# EAGLE design MAIN_CNTRL_v01 (EAGLE 9.7.0)

## Sheet 1 of 5
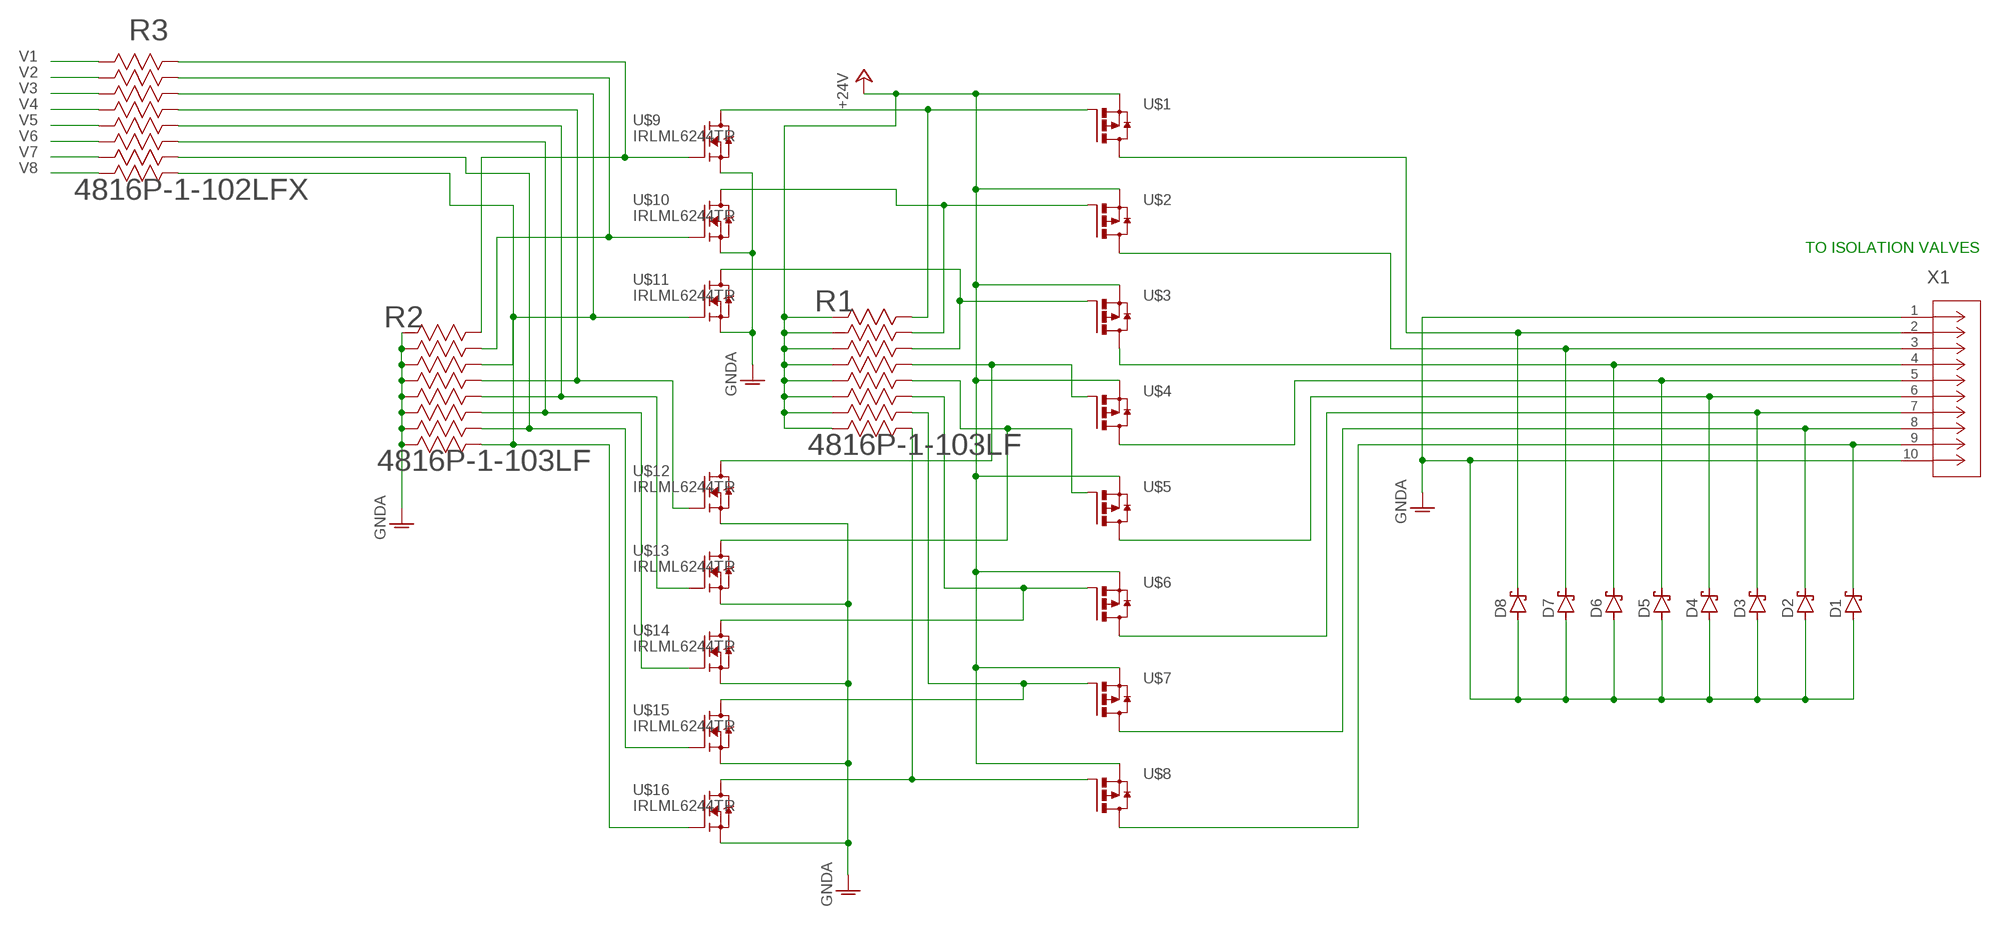
[diagram p0: schematic, sheet 1]

### Parts
D1  RB168VYM150FHTR  [DIO_RB160VAM_ROM]
D2  RB168VYM150FHTR  [DIO_RB160VAM_ROM]
D3  RB168VYM150FHTR  [DIO_RB160VAM_ROM]
D4  RB168VYM150FHTR  [DIO_RB160VAM_ROM]
D5  RB168VYM150FHTR  [DIO_RB160VAM_ROM]
D6  RB168VYM150FHTR  [DIO_RB160VAM_ROM]
D7  RB168VYM150FHTR  [DIO_RB160VAM_ROM]
D8  RB168VYM150FHTR  [DIO_RB160VAM_ROM]
R1  4816P-1-103LF  [BO_4816P]
R2  4816P-1-103LF  [BO_4816P]
R3  4816P-1-102LFX  4816P-1-102LF  [BO_4816P]
U$1  ZXMP7A17SOT223A  [SOT223]
U$2  ZXMP7A17SOT223A  [SOT223]
U$3  ZXMP7A17SOT223A  [SOT223]
U$4  ZXMP7A17SOT223A  [SOT223]
U$5  ZXMP7A17SOT223A  [SOT223]
U$6  ZXMP7A17SOT223A  [SOT223]
U$7  ZXMP7A17SOT223A  [SOT223]
U$8  ZXMP7A17SOT223A  [SOT223]
U$9  IRLML6244TR  [SOT23]
U$10  IRLML6244TR  [SOT23]
U$11  IRLML6244TR  [SOT23]
U$12  IRLML6244TR  [SOT23]
U$13  IRLML6244TR  [SOT23]
U$14  IRLML6244TR  [SOT23]
U$15  IRLML6244TR  [SOT23]
U$16  IRLML6244TR  [SOT23]
X1  FH52-10S-0.5SH  [CONN10_FH52-10S-0.5SH_HIR]

### Nets
+24V: R1.1 R1.2 R1.3 R1.4 R1.5 R1.6 R1.7 R1.8 U$1.3(S) U$2.3(S) U$3.3(S) U$4.3(S) U$5.3(S) U$6.3(S) U$7.3(S) U$8.3(S) ; also sheet 3,4,5
GNDA: D1.2(A) D2.2(A) D3.2(A) D4.2(A) D5.2(A) D6.2(A) D7.2(A) D8.2(A) R2.1 R2.2 R2.3 R2.4 R2.5 R2.6 R2.7 R2.8 U$9.2(S) U$10.2(S) U$11.2(S) U$12.2(S) U$13.2(S) U$14.2(S) U$15.2(S) U$16.2(S) X1.1 X1.10 ; also sheet 2,3,4,5
N$1: D8.1(C) U$1.2(D) U$1.4(D) X1.2
N$1-1: R1.16 U$1.1(G) U$9.3(D)
N$1-2: R2.16 R3.16 U$9.1(G)
N$2: D7.1(C) U$2.2(D) U$2.4(D) X1.3
N$2-1: R1.15 U$2.1(G) U$10.3(D)
N$2-2: R2.15 R3.15 U$10.1(G)
N$3: D6.1(C) U$3.2(D) U$3.4(D) X1.4
N$3-1: R1.14 U$3.1(G) U$11.3(D)
N$4: D5.1(C) U$4.2(D) U$4.4(D) X1.5
N$4-1: R1.13 U$4.1(G) U$12.3(D)
N$4-2: R2.13 R3.13 U$12.1(G)
N$5: D4.1(C) U$5.2(D) U$5.4(D) X1.6
N$5-1: R1.12 U$5.1(G) U$13.3(D)
N$5-2: R2.12 R3.12 U$13.1(G)
N$6: D3.1(C) U$6.2(D) U$6.4(D) X1.7
N$6-1: R1.11 U$6.1(G) U$14.3(D)
N$6-2: R2.11 R3.11 U$14.1(G)
N$7: D2.1(C) U$7.2(D) U$7.4(D) X1.8
N$7-1: R1.10 U$7.1(G) U$15.3(D)
N$7-2: R2.10 R3.10 U$15.1(G)
N$8: D1.1(C) U$8.2(D) U$8.4(D) X1.9
N$8-1: R1.9 U$8.1(G) U$16.3(D)
N$8-2: R2.9 R2.14 R3.9 R3.14 U$11.1(G) U$16.1(G)
V1: R3.1 ; also sheet 2
V2: R3.2 ; also sheet 2
V3: R3.3 ; also sheet 2
V4: R3.4 ; also sheet 2
V5: R3.5 ; also sheet 2
V6: R3.6 ; also sheet 2
V7: R3.7 ; also sheet 2
V8: R3.8 ; also sheet 2

### Notes on the sheet
- TO ISOLATION VALVES

## Sheet 2 of 5
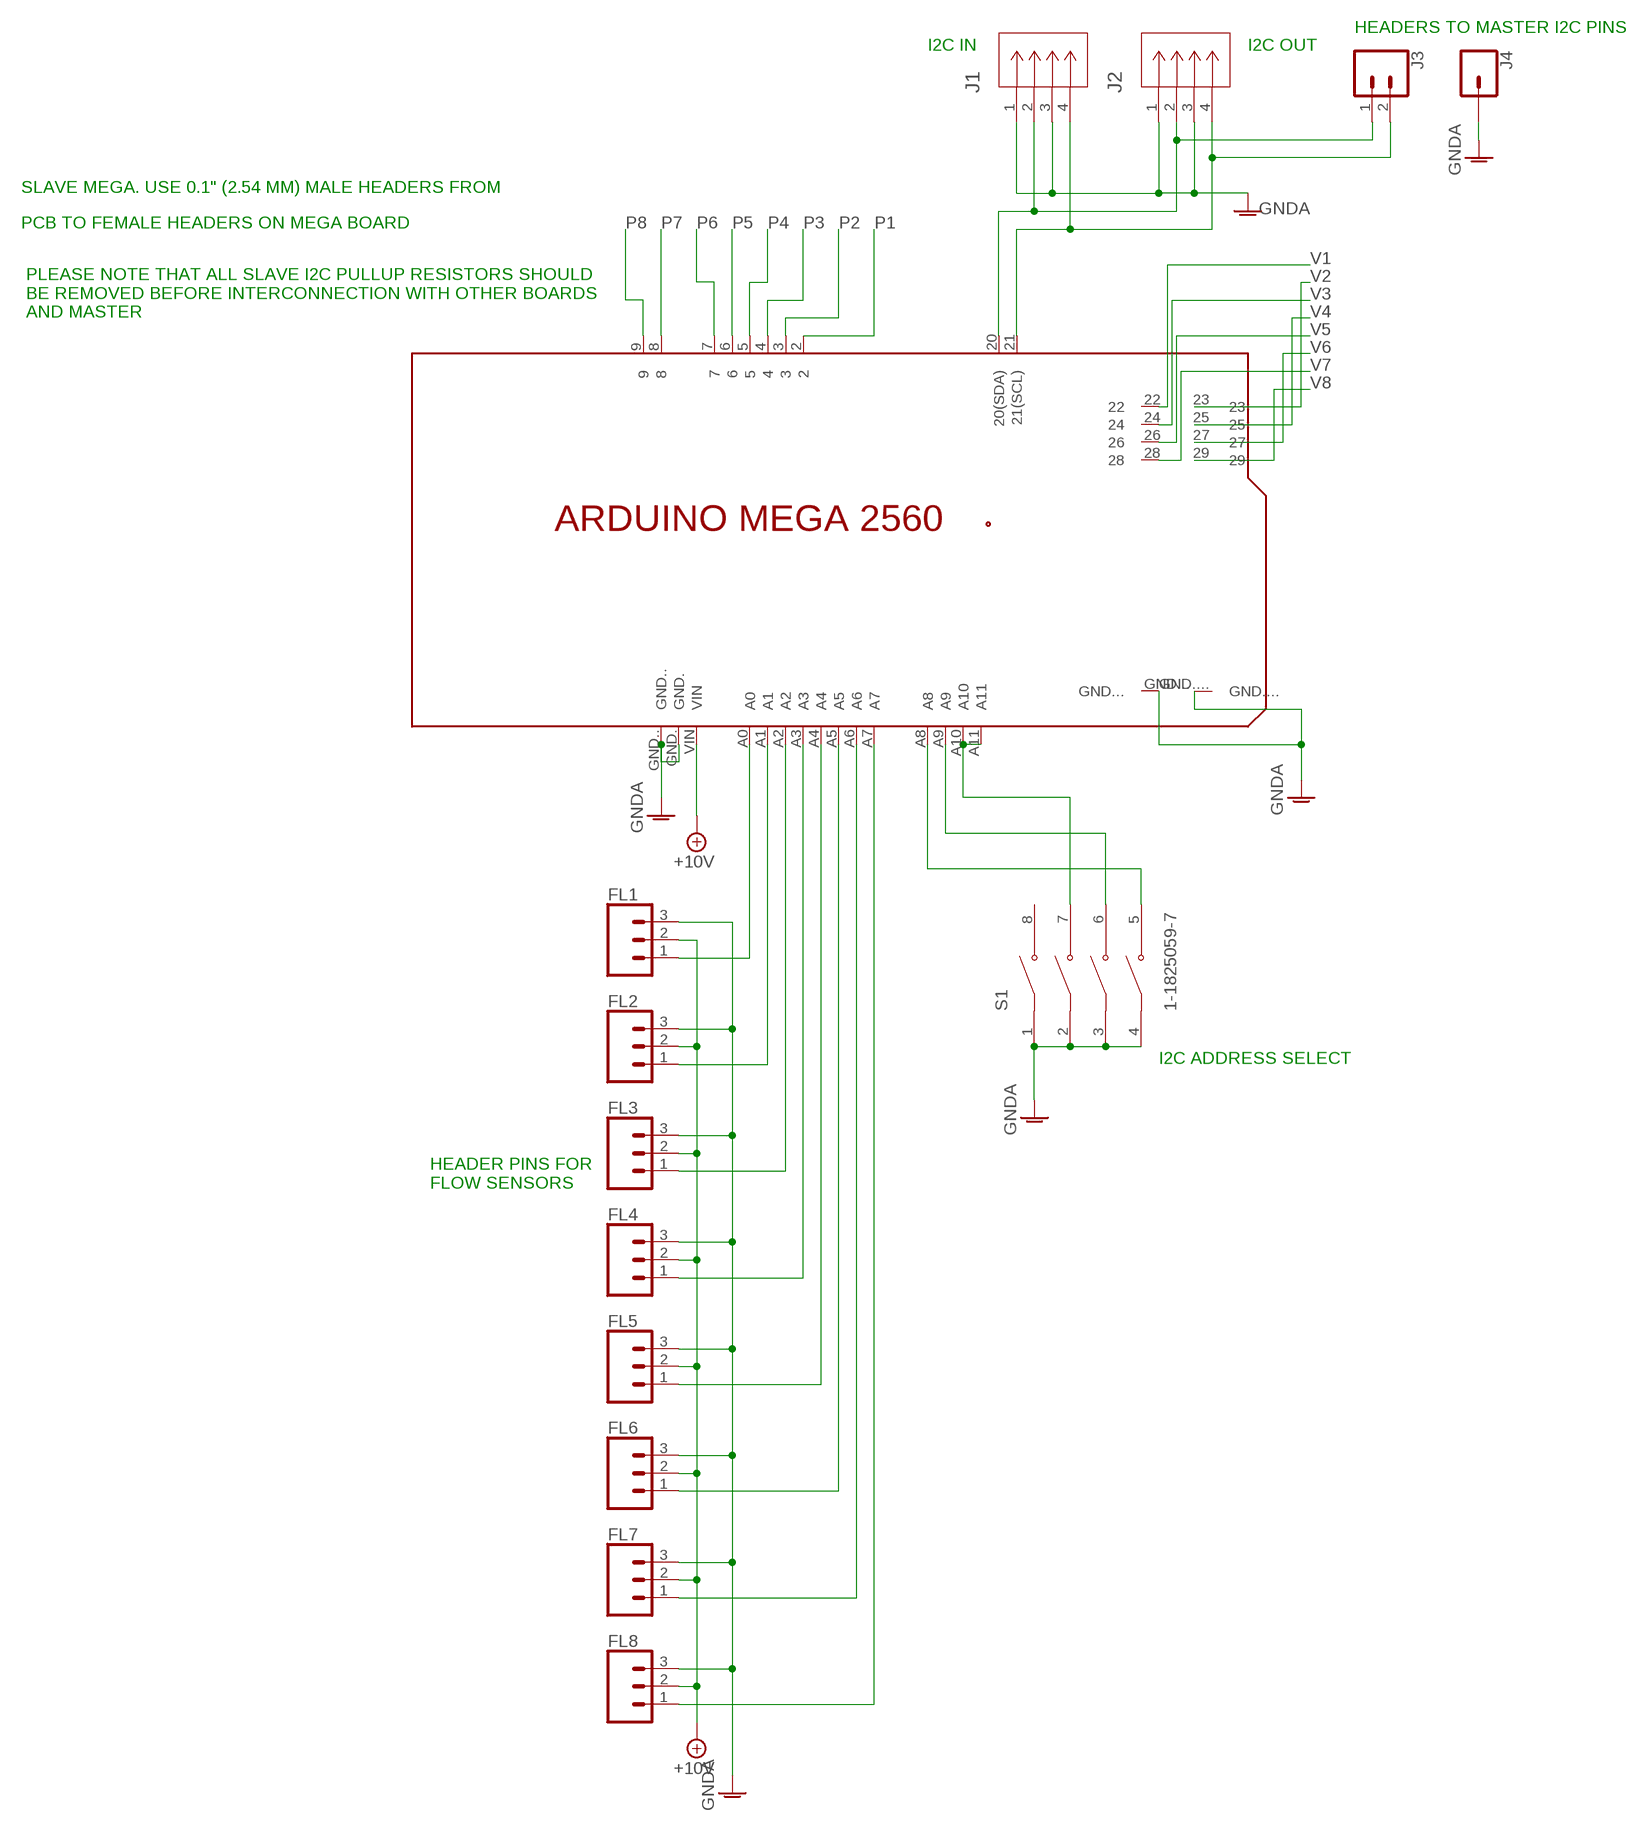
[diagram p1: schematic, sheet 2]

### Parts
FL1  CONN_03_FL  [1X03_FL]
FL2  CONN_03_FL  [1X03_FL]
FL3  CONN_03_FL  [1X03_FL]
FL4  CONN_03_FL  [1X03_FL]
FL5  CONN_03_FL  [1X03_FL]
FL6  CONN_03_FL  [1X03_FL]
FL7  CONN_03_FL  [1X03_FL]
FL8  CONN_03_FL  [1X03_FL]
J1  MOLEX_436500415  [MOLEX_4P_FOOTPRINT]
J2  MOLEX_436500415  [MOLEX_4P_FOOTPRINT]
J3  CONN_02  [1X02]
J4  CONN_01  [1X01]
PCB1  ARDUINO_MEGA2560_HEADERPINSXX  [ARDUINO_MEGA2560_ST_FLIPPED_CUTS]
S1  1-1825059-7  [SW_1-1825059-7]

### Nets
+10V: FL1.2 FL2.2 FL3.2 FL4.2 FL5.2 FL6.2 FL7.2 FL8.2 PCB1.VIN ; also sheet 3,4,5
GNDA: FL1.3 FL2.3 FL3.3 FL4.3 FL5.3 FL6.3 FL7.3 FL8.3 J1.1 J1.3 J2.1 J2.3 J4.1 PCB1.GND. PCB1.GND.. PCB1.GND... PCB1.GND.... S1.1 S1.2 S1.3 S1.4 ; also sheet 1,3,4,5
N$80: PCB1.A8 S1.5
N$81: PCB1.A9 S1.6
N$82: J1.2 J2.2 J3.1 PCB1.20(20(SDA))
N$83: PCB1.A10 PCB1.A11 S1.7
N$84: J1.4 J2.4 J3.2 PCB1.21(21(SCL))
N$A0: FL1.1 PCB1.A0
N$A1: FL2.1 PCB1.A1
N$A2: FL3.1 PCB1.A2
N$A3: FL4.1 PCB1.A3
N$A4: FL5.1 PCB1.A4
N$A5: FL6.1 PCB1.A5
N$A6: FL7.1 PCB1.A6
N$A7: FL8.1 PCB1.A7
P1: PCB1.2 ; also sheet 3
P2: PCB1.3 ; also sheet 3
P3: PCB1.4 ; also sheet 3
P4: PCB1.5 ; also sheet 3
P5: PCB1.6 ; also sheet 4
P6: PCB1.7 ; also sheet 4
P7: PCB1.8 ; also sheet 4
P8: PCB1.9 ; also sheet 4
V1: PCB1.22 ; also sheet 1
V2: PCB1.23 ; also sheet 1
V3: PCB1.24 ; also sheet 1
V4: PCB1.25 ; also sheet 1
V5: PCB1.26 ; also sheet 1
V6: PCB1.27 ; also sheet 1
V7: PCB1.28 ; also sheet 1
V8: PCB1.29 ; also sheet 1
Unconnected: S1.8

### Notes on the sheet
- HEADERS TO MASTER I2C PINS
- I2C IN | I2C OUT
- SLAVE MEGA. USE 0.1" (2.54 MM) MALE HEADERS FROM
- PCB TO FEMALE HEADERS ON MEGA BOARD
- PLEASE NOTE THAT ALL SLAVE I2C PULLUP RESISTORS SHOULD
   BE REMOVED BEFORE INTERCONNECTION WITH OTHER BOARDS
   AND MASTER
- I2C ADDRESS SELECT
- HEADER PINS FOR
  FLOW SENSORS

## Sheet 3 of 5
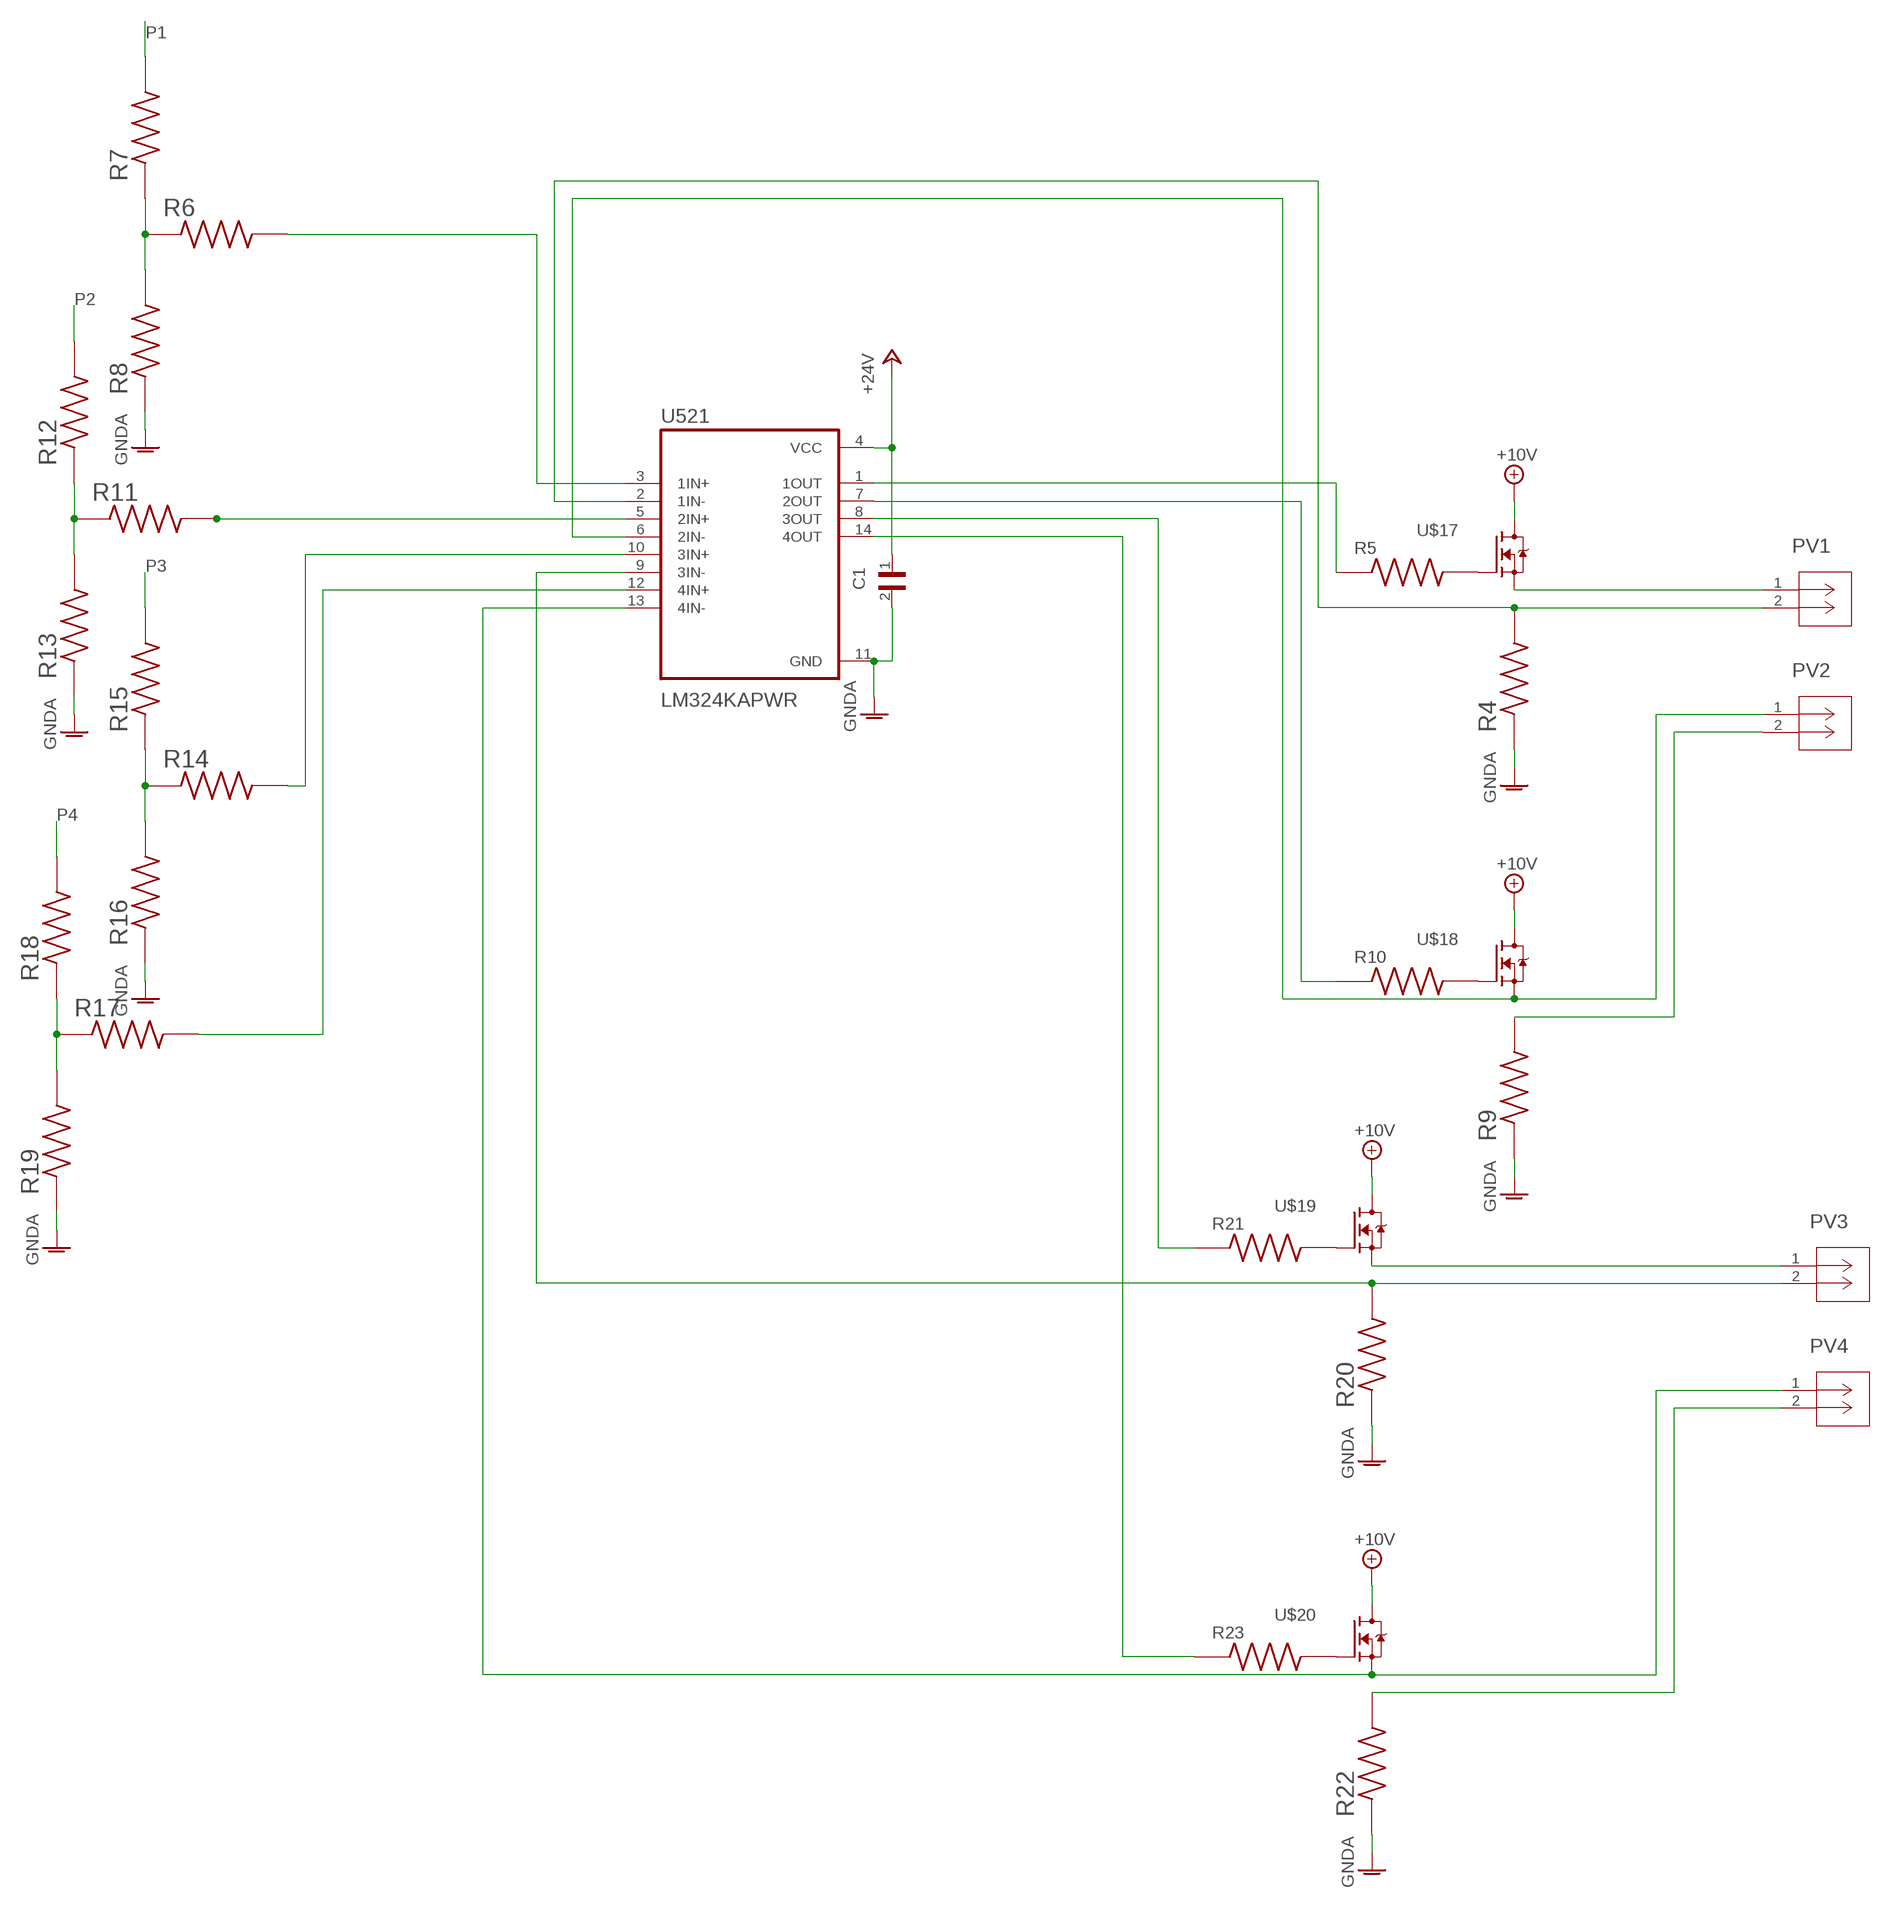
[diagram p2: schematic, sheet 3]

### Parts
C1  CGA3E2X7R1H104M080AD  [CAP_1608_TDK]
PV1  MOLEX_2P_PVALVES  [MOLEX_2P_PVALVES]
PV2  MOLEX_2P_PVALVES  [MOLEX_2P_PVALVES]
PV3  MOLEX_2P_PVALVES  [MOLEX_2P_PVALVES]
PV4  MOLEX_2P_PVALVES  [MOLEX_2P_PVALVES]
R4  CRCW12062R20FKEA  [RESC3116X60N]
R5  ERJPA3F1001V  [RES_ERJPA3F1001V]
R6  SR0603FR-7T100KL  [RESC1608X55N]
R7  SR0603FR-7T2K2L  [RESC1608X55N]
R8  RCS0603120RFKEA  [RESC1508X50N]
R9  CRCW12062R20FKEA  [RESC3116X60N]
R10  ERJPA3F1001V  [RES_ERJPA3F1001V]
R11  SR0603FR-7T100KL  [RESC1608X55N]
R12  SR0603FR-7T2K2L  [RESC1608X55N]
R13  RCS0603120RFKEA  [RESC1508X50N]
R14  SR0603FR-7T100KL  [RESC1608X55N]
R15  SR0603FR-7T2K2L  [RESC1608X55N]
R16  RCS0603120RFKEA  [RESC1508X50N]
R17  SR0603FR-7T100KL  [RESC1608X55N]
R18  SR0603FR-7T2K2L  [RESC1608X55N]
R19  RCS0603120RFKEA  [RESC1508X50N]
R20  CRCW12062R20FKEA  [RESC3116X60N]
R21  ERJPA3F1001V  [RES_ERJPA3F1001V]
R22  CRCW12062R20FKEA  [RESC3116X60N]
R23  ERJPA3F1001V  [RES_ERJPA3F1001V]
U521  LM324KAPWR  [SOP65P640X120-14N]
U$17  IRLML6244TR  [SOT23]
U$18  IRLML6244TR  [SOT23]
U$19  IRLML6244TR  [SOT23]
U$20  IRLML6244TR  [SOT23]

### Nets
+10V: U$17.3(D) U$18.3(D) U$19.3(D) U$20.3(D) ; also sheet 2,4,5
+24V: C1.1 U521.4(VCC) ; also sheet 1,4,5
GNDA: C1.2 R4.1 R8.1 R9.1 R13.1 R16.1 R19.1 R20.1 R22.1 U521.11(GND) ; also sheet 1,2,4,5
N$26: R5.2 U$17.1(G)
N$27: R5.1 U521.1(1OUT)
N$28: R6.2 U521.3(1IN+)
N$29: R6.1 R7.1 R8.2
N$30: R10.1 U521.7(2OUT)
N$32: R10.2 U$18.1(G)
N$34: R11.1 R12.1 R13.2
N$35: R11.2 U521.5(2IN+)
N$36: R14.1 R15.1 R16.2
N$37: R14.2 U521.10(3IN+)
N$38: R17.1 R18.1 R19.2
N$39: R17.2 U521.12(4IN+)
N$42: R21.2 U$19.1(G)
N$43: R21.1 U521.8(3OUT)
N$46: R23.2 U$20.1(G)
N$47: R23.1 U521.14(4OUT)
N$PV1_1: PV1.1 U$17.2(S)
N$PV1_2: PV1.2 R4.2 U521.2(1IN-)
N$PV2_1: PV2.1 U521.6(2IN-) U$18.2(S)
N$PV2_2: PV2.2 R9.2
N$PV3_1: PV3.1 U$19.2(S)
N$PV3_2: PV3.2 R20.2 U521.9(3IN-)
N$PV4_1: PV4.1 U521.13(4IN-) U$20.2(S)
N$PV4_2: PV4.2 R22.2
P1: R7.2 ; also sheet 2
P2: R12.2 ; also sheet 2
P3: R15.2 ; also sheet 2
P4: R18.2 ; also sheet 2

## Sheet 4 of 5
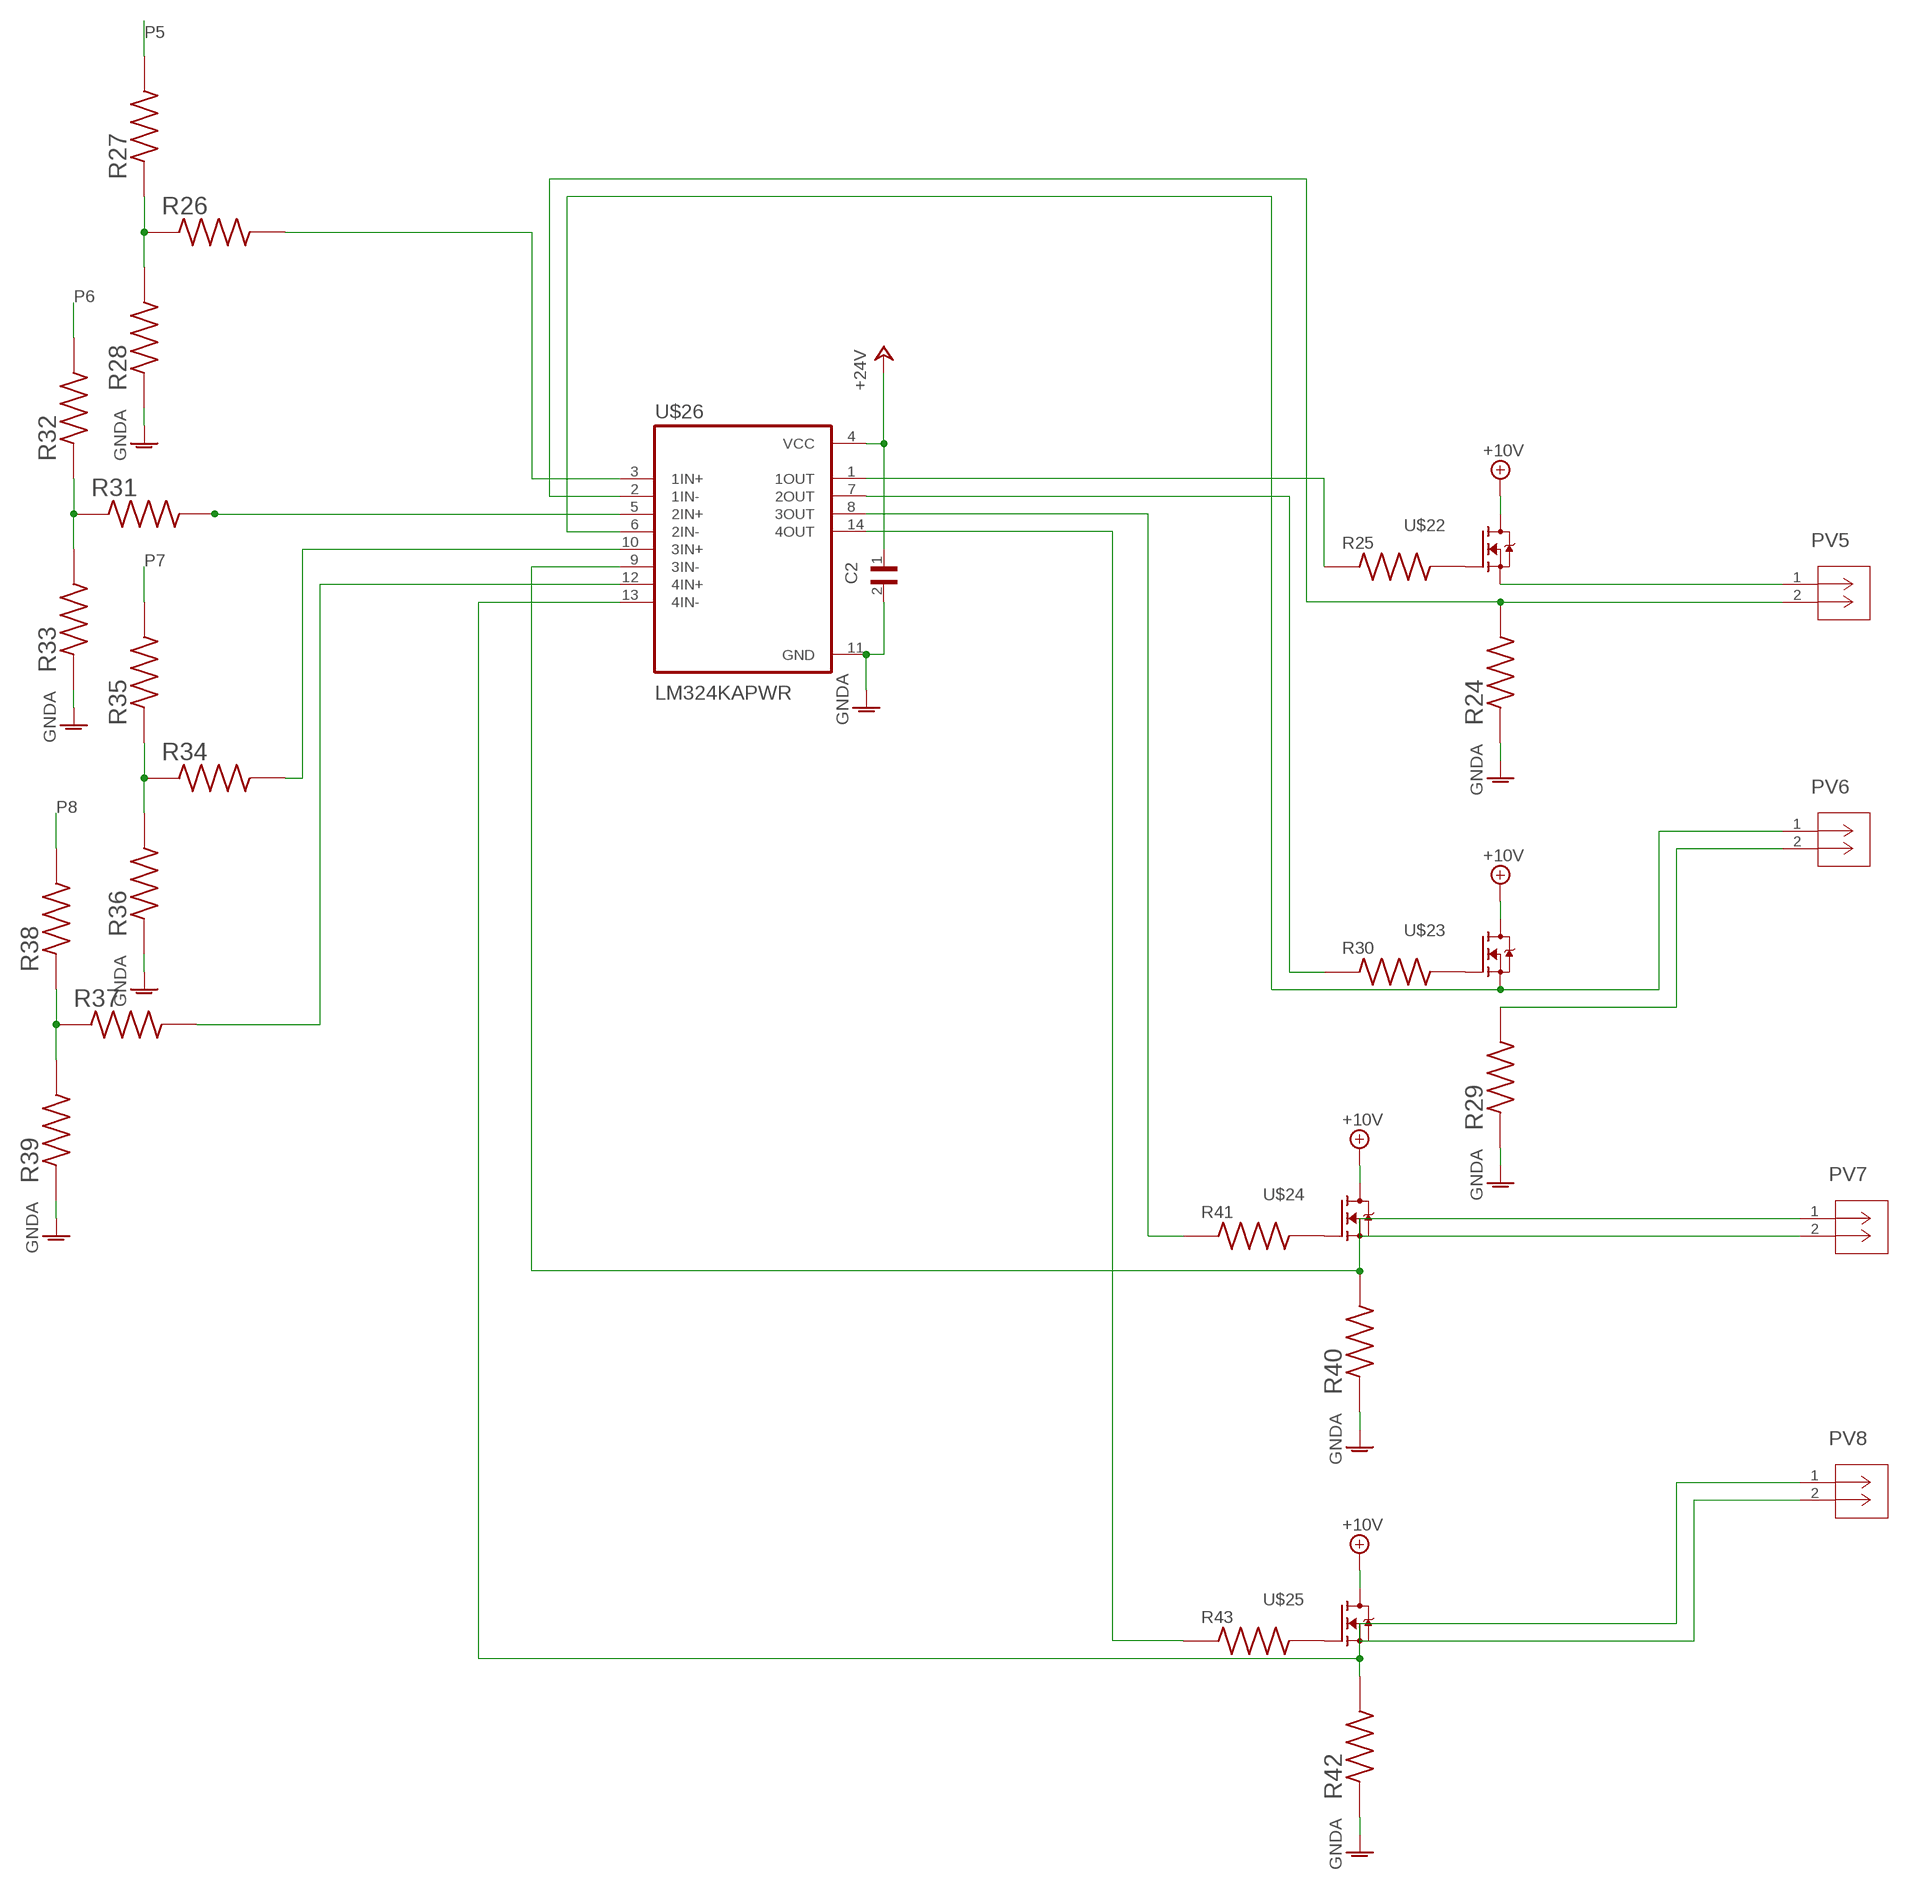
[diagram p3: schematic, sheet 4]

### Parts
C2  CGA3E2X7R1H104M080AD  [CAP_1608_TDK]
PV5  MOLEX_2P_PVALVES  [MOLEX_2P_PVALVES]
PV6  MOLEX_2P_PVALVES  [MOLEX_2P_PVALVES]
PV7  MOLEX_2P_PVALVES  [MOLEX_2P_PVALVES]
PV8  MOLEX_2P_PVALVES  [MOLEX_2P_PVALVES]
R24  CRCW12062R20FKEA  [RESC3116X60N]
R25  ERJPA3F1001V  [RES_ERJPA3F1001V]
R26  SR0603FR-7T100KL  [RESC1608X55N]
R27  SR0603FR-7T2K2L  [RESC1608X55N]
R28  RCS0603120RFKEA  [RESC1508X50N]
R29  CRCW12062R20FKEA  [RESC3116X60N]
R30  ERJPA3F1001V  [RES_ERJPA3F1001V]
R31  SR0603FR-7T100KL  [RESC1608X55N]
R32  SR0603FR-7T2K2L  [RESC1608X55N]
R33  RCS0603120RFKEA  [RESC1508X50N]
R34  SR0603FR-7T100KL  [RESC1608X55N]
R35  SR0603FR-7T2K2L  [RESC1608X55N]
R36  RCS0603120RFKEA  [RESC1508X50N]
R37  SR0603FR-7T100KL  [RESC1608X55N]
R38  SR0603FR-7T2K2L  [RESC1608X55N]
R39  RCS0603120RFKEA  [RESC1508X50N]
R40  CRCW12062R20FKEA  [RESC3116X60N]
R41  ERJPA3F1001V  [RES_ERJPA3F1001V]
R42  CRCW12062R20FKEA  [RESC3116X60N]
R43  ERJPA3F1001V  [RES_ERJPA3F1001V]
U$22  IRLML6244TR  [SOT23]
U$23  IRLML6244TR  [SOT23]
U$24  IRLML6244TR  [SOT23]
U$25  IRLML6244TR  [SOT23]
U$26  LM324KAPWR  [SOP65P640X120-14N]

### Nets
+10V: U$22.3(D) U$23.3(D) U$24.3(D) U$25.3(D) ; also sheet 2,3,5
+24V: C2.1 U$26.4(VCC) ; also sheet 1,3,5
GNDA: C2.2 R24.1 R28.1 R29.1 R33.1 R36.1 R39.1 R40.1 R42.1 U$26.11(GND) ; also sheet 1,2,3,5
N$50: R25.2 U$22.1(G)
N$51: R25.1 U$26.1(1OUT)
N$52: R26.1 R27.1 R28.2
N$54: R30.2 U$23.1(G)
N$56: R26.2 U$26.3(1IN+)
N$57: R31.1 R32.1 R33.2
N$58: R31.2 U$26.5(2IN+)
N$59: R34.1 R35.1 R36.2
N$60: R34.2 U$26.10(3IN+)
N$61: R37.1 R38.1 R39.2
N$62: R37.2 U$26.12(4IN+)
N$65: R41.2 U$24.1(G)
N$66: R41.1 U$26.8(3OUT)
N$69: R43.2 U$25.1(G)
N$70: R43.1 U$26.14(4OUT)
N$71: R30.1 U$26.7(2OUT)
N$PV5_1: PV5.1 U$22.2(S)
N$PV5_2: PV5.2 R24.2 U$26.2(1IN-)
N$PV6_1: PV6.1 U$23.2(S) U$26.6(2IN-)
N$PV6_2: PV6.2 R29.2
N$PV7_1: PV7.1 U$24.2(S)
N$PV7_2: PV7.2 R40.2 U$26.9(3IN-)
N$PV8_1: PV8.1 U$25.2(S) U$26.13(4IN-)
N$PV8_2: PV8.2 R42.2
P5: R27.2 ; also sheet 2
P6: R32.2 ; also sheet 2
P7: R35.2 ; also sheet 2
P8: R38.2 ; also sheet 2

## Sheet 5 of 5
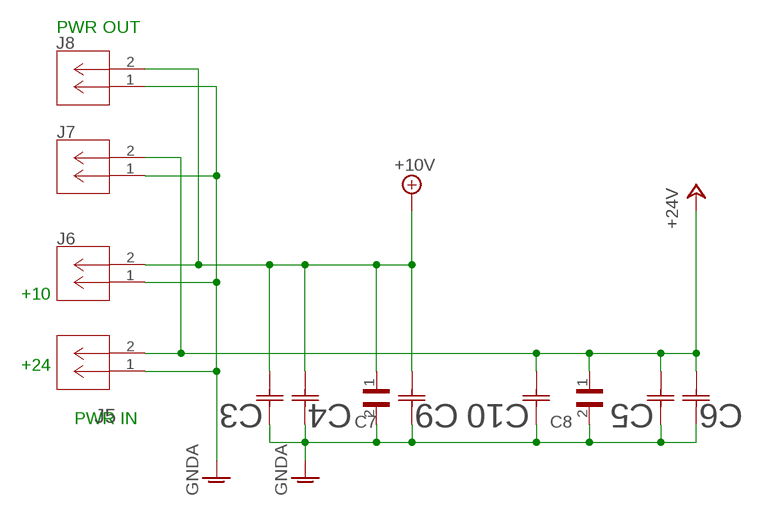
[diagram p4: schematic, sheet 5]

### Parts
C3  50THV100M10X10.5  [CAP_J-V_10X10P5_RUB]
C4  50THV100M10X10.5  [CAP_J-V_10X10P5_RUB]
C5  50THV100M10X10.5  [CAP_J-V_10X10P5_RUB]
C6  50THV100M10X10.5  [CAP_J-V_10X10P5_RUB]
C7  CGA3E2X7R1H104M080AD  [CAP_1608_TDK]
C8  CGA3E2X7R1H104M080AD  [CAP_1608_TDK]
C9  CGA3E2X7R1H103K080AE  [CAP_1608_TDK]
C10  CGA3E2X7R1H103K080AE  [CAP_1608_TDK]
J5  MOLEX_436500215  [MOLEX_2P_FOOTPRINT]
J6  MOLEX_436500215  [MOLEX_2P_FOOTPRINT]
J7  MOLEX_436500215  [MOLEX_2P_FOOTPRINT]
J8  MOLEX_436500215  [MOLEX_2P_FOOTPRINT]

### Nets
+10V: C3.2 C4.2 C7.1 C9.2 J6.2 J8.2 ; also sheet 2,3,4
+24V: C5.2 C6.2 C8.1 C10.2 J5.2 J7.2 ; also sheet 1,3,4
GNDA: C3.1 C4.1 C5.1 C6.1 C7.2 C8.2 C9.1 C10.1 J5.1 J6.1 J7.1 J8.1 ; also sheet 1,2,3,4

### Notes on the sheet
- PWR OUT
- +10
- +24
- PWR IN

## Library data of the parts
C1 C2 C7 C8 = lib_v3:CGA3E2X7R1H104M080AD: Cap Ceramic 0.1uF 50V X7R 20% SMD 0603 125°C Punched Paper T/R; DIGI-KEY_PART_NUMBER: 445-9834-1-ND; DIGIKEY_LINK: https://www.digikey.com/en/products/detail/tdk-corporation/CGA3E2X7R1H104M080AD/3933567?s=N4IgTCBcDaIMIHECCBmAomAGgdgEoEYAJfABgBYBZEgDhKQBEQBdAXyA
C3-C6 = lib_v3:50THV100M10X10.5; COPYRIGHT: Copyright (C) 2021 Ultra Librarian. All rights reserved.; DIGI-KEY_PART_NUMBER: 1189-2059-1-ND; DIGIKEY_LINK: https://www.digikey.com/en/products/detail/rubycon/50THV100M10X10-5/3568792?s=N4IgTCBcDaIIxwBwE4C0YAMBWNdUDkAREAXQF8g; MANUFACTURER_PART_NUMBER: 50THV100M10X10.5; MF: Rubycon; NOTE: assumed polarity does not matter
C9 C10 = lib_v3:CGA3E2X7R1H103K080AE; COPYRIGHT: Copyright (C) 2021 Ultra Librarian. All rights reserved.; DIGI-KEY_PART_NUMBER: 445-15955-1-ND; DIGIKEY_LINK: https://www.digikey.com/en/products/detail/tdk-corporation/CGA3E2X7R1H103K080AE/4490592?s=N4IgTCBcDaICxwKwFoCMiCciVmQOQBEQBdAXyA; MANUFACTURER_PART_NUMBER: CGA3E2X7R1H103K080AE; MF: TDK
D1-D8 = lib_v3:RB168VYM150FHTR; BUILT_BY: EMA_Matt; COPYRIGHT: Copyright (C) 2018 Accelerated Designs. All rights reserved; DIGI-KEY_PART_NUMBER: RB168VYM150FHCT-ND; DIGIKEY_LINK: https://www.digikey.com/en/products/detail/rohm-semiconductor/RB168VYM150FHTR/8028502; MANUFACTURER_PART_NUMBER: RB168VYM150FHTR; MF: ROHM Semiconductor; SOURCELIBRARY: Rohm_2019-09-23; SPICEPREFIX: D
FL1-FL8 = lib_v3:CONN_03_FL: Multi connection point. Often used as Generic Header-pin footprint for 0.1 inch spaced/style header connections On any of the 0.1 inch spaced packages, you can populate with these: Break Away Headers - Straight <https://www.sparkfun.com/products/116> (PRT-00116) Break Away Male Headers - Right Angle <https://www.sparkfun.com/products/553> (PRT-00553) Female Headers <https://www.sparkfun.com/products/115> (PRT-00115) Break Away Headers - Machine Pin <https://www.sparkfun.com/products/117> (PRT-00117) Break Away Female Headers - Swiss Machine Pin <https://www.sparkfun.com/products/743> (PRT-00743) Stackable Header - 3 Pin (Female, 0.1") <https://www.sparkfun.com/products/13875> (PRT-13875) For SCREWTERMINALS and SPRING TERMINALS visit here: Screw Terimnals on SparkFun.com <https://www.sparkfun.com/search/results?term=Screw+Terminals> (5mm/3.5mm/2.54mm spacing) This device is also useful as a general connection point to wire up your design to another part of your project. Our various solder wires solder well into these plated through hole pads. Hook-Up Wire - Assortment (Stranded, 22 AWG) <https://www.sparkfun.com/products/11375> (PRT-11375) Hook-Up Wire - Assortment (Solid Core, 22 AWG) <https://www.sparkfun.com/products/11367> (PRT-11367) View the entire wire category on our website here <https://www.sparkfun.com/categories/141> Special notes: Molex polarized connector foot print use with SKU : PRT-08232 with associated crimp pins and housings.; DIGI-KEY_PART_NUMBER: S7036-ND; DIGIKEY_LINK: https://www.digikey.com/en/products/detail/sullins-connector-solutions/PPPC031LFBN-RC/810175
J1 J2 = lib_v3:MOLEX_436500415; DIGI-KEY_PART_NUMBER: WM1919-ND; DIGIKEY_LINK: https://www.digikey.com/en/products/detail/molex/0436500415/283463?s=N4IgTCBcDaIOoFkCMBOVBaAcgERAXQF8g
J3 = lib_v3:CONN_02: Multi connection point. Often used as Generic Header-pin footprint for 0.1 inch spaced/style header connections On any of the 0.1 inch spaced packages, you can populate with these: Break Away Headers - Straight <https://www.sparkfun.com/products/116> (PRT-00116) Break Away Male Headers - Right Angle <https://www.sparkfun.com/products/553> (PRT-00553) Female Headers <https://www.sparkfun.com/products/115> (PRT-00115) Break Away Headers - Machine Pin <https://www.sparkfun.com/products/117> (PRT-00117) Break Away Female Headers - Swiss Machine Pin <https://www.sparkfun.com/products/743> (PRT-00743) For SCREWTERMINALS and SPRING TERMINALS visit here: Screw Terimnals on SparkFun.com <https://www.sparkfun.com/search/results?term=Screw+Terminals> (5mm/3.5mm/2.54mm spacing) This device is also useful as a general connection point to wire up your design to another part of your project. Our various solder wires solder well into these plated through hole pads. Hook-Up Wire - Assortment (Stranded, 22 AWG) <https://www.sparkfun.com/products/11375> (PRT-11375) Hook-Up Wire - Assortment (Solid Core, 22 AWG) <https://www.sparkfun.com/products/11367> (PRT-11367) View the entire wire category on our website here <https://www.sparkfun.com/categories/141> Special notes: Molex polarized connector foot print use with: PRT-08233 with associated crimp pins and housings. 2.54_SCREWTERM for use with PRT-10571. 3.5mm Screw Terminal footprints for PRT-08084 5mm Screw Terminal footprints for use with PRT-08432; DIGI-KEY_PART_NUMBER: 3M9457-36-ND; DIGIKEY_LINK: https://www.digikey.com/en/products/detail/3m/9611; NOTE: from Sparkfun Connectors library
J4 = lib_v3:CONN_01: Single connection point. Often used as Generic Header-pin footprint for 0.1 inch spaced/style header connections On any of the 0.1 inch spaced packages, you can populate with these: Break Away Headers - Straight <https://www.sparkfun.com/products/116> (PRT-00116) Break Away Male Headers - Right Angle <https://www.sparkfun.com/products/553> (PRT-00553) Female Headers <https://www.sparkfun.com/products/115> (PRT-00115) Break Away Headers - Machine Pin <https://www.sparkfun.com/products/117> (PRT-00117) Break Away Female Headers - Swiss Machine Pin <https://www.sparkfun.com/products/743> (PRT-00743) This device is also useful as a general connection point to wire up your design to another part of your project. Our various solder wires solder well into these plated through hole pads. Hook-Up Wire - Assortment (Stranded, 22 AWG) <https://www.sparkfun.com/products/11375> (PRT-11375) Hook-Up Wire - Assortment (Solid Core, 22 AWG) <https://www.sparkfun.com/products/11367> (PRT-11367) View the entire wire category on our website here <https://www.sparkfun.com/categories/141> Special notes: SMTSO-256-ET is a "flush mount" nut for a 4-40 screw. We mostly use this on specialty testbeds; it is a nice way to connect hardware to your PCB at an adjustable hieght. Also note, the SNAP packages are for using a snappable style connector. We sell a baggie of snaps and they are also used on two LilyPad designs: Snap Assortment - 30 pack (male and female) <https://www.sparkfun.com/products/11347> (DEV-11347) LilyPad Arduino SimpleSnap <https://www.sparkfun.com/products/10941> (DEV-10941) LilyPad SimpleSnap Protoboard <https://www.sparkfun.com/products/10940> (DEV-10940)
J5-J8 = lib_v3:MOLEX_436500215; DIGI-KEY_PART_NUMBER: WM1917-ND; DIGIKEY_LINK: https://www.digikey.com/en/products/detail/molex/0436500215/283461?s=N4IgTCBcDaIOoFkCMBOJB2AtAOQCIgF0BfIA
PCB1 = lib_v3:ARDUINO_MEGA2560_HEADERPINS
PV1-PV8 = lib_v3:MOLEX_2P_PVALVES: identical to MOLEX_436500215; + name on bottom; DIGI-KEY_PART_NUMBER: WM1917-ND; DIGIKEY_LINK: https://www.digikey.com/en/products/detail/molex/0436500215/283461?s=N4IgTCBcDaIOoFkCMBOJB2AtAOQCIgF0BfIA
R1 R2 = lib_v3:4816P-1-103LF; BUILT_BY: EMA_UL_Team; DIGI-KEY_PART_NUMBER: 4816P-1-103LFCT-ND; DIGIKEY_LINK: https://www.digikey.com/en/products/detail/bourns-inc/4816P-1-103LF/1958036?s=N4IgTCBcDaICwA4CMA2ACgWiVgDAZgBkAxEAXQF8g; MANUFACTURER_PART_NUMBER: 4816P-1-103LF; MF: Bourns Electronics; SOURCELIBRARY: Bourns_2014-12-31; SPICEPREFIX: X
R3 = lib_v3:4816P-1-102LF; BUILT_BY: EMA_UL_Team; DIGI-KEY_PART_NUMBER: 4816P-1-102LFCT-ND; DIGIKEY_LINK: https://www.digikey.com/en/products/detail/bourns-inc/4816P-1-102LF/1958035?s=N4IgTCBcDaICwA4CMA2ACgWiVgDGAMgGIgC6AvkA; MANUFACTURER_PART_NUMBER: 4816P-1-102LF; MF: Bourns Electronics; SOURCELIBRARY: Bourns_2014-12-31; SPICEPREFIX: X
R4 R9 R20 R22 R24 R29 R40 R42 = lib_v3:CRCW12062R20FKEA: RES, THICK FILM, 2R2, 1%, 0.25W, 1206, R; DESCRIPTION: 2.2 Ohms ±1% 0.25W, 1/4W Chip Resistor 1206 (3216 Metric) Automotive AEC-Q200 Thick Film; DIGI-KEY_PART_NUMBER: 541-2.20FFCT-ND; DIGIKEY_LINK: https://www.digikey.com/en/products/detail/vishay-dale/CRCW12062R20FKEA/1961801?s=N4IgTCBcDaIKwBYCMBaMA6MAGAYjgwgCooByAIiALoC%2BQA; MANUFACTURER_PART_NUMBER: CRCW12062R20FKEA; MF: Vishay Dale; PACKAGE: 3116 Vishay; PURCHASE-URL: https://pricing.snapeda.com/search/part/CRCW12062R20FKEA/?ref=eda
R5 R10 R21 R23 R25 R30 R41 R43 = lib_v3:ERJPA3F1001V; DESCRIPTION: 1 kOhms ±1% 0.25W, 1/4W Chip Resistor 0603 (1608 Metric) Automotive AEC-Q200, Pulse Withstanding Thick Film; DIGI-KEY_PART_NUMBER: P1.0KBYCT-ND; DIGIKEY_LINK: https://www.digikey.com/en/products/detail/panasonic-electronic-components/ERJ-PA3F1001V/5035848?s=N4IgTCBcDaIAoEYB0AGA0gIQJoGEAqAtAHIAiIAugL5A; MANUFACTURER_PART_NUMBER: ERJPA3F1001V; MF: Panasonic; PACKAGE: 1608-2 Panasonic
R6 R11 R14 R17 R26 R31 R34 R37 = lib_v3:SR0603FR-7T100KL; DESCRIPTION: 100 kOhms ±1% 0.25W, 1/4W Chip Resistor 0603 (1608 Metric) Automotive AEC-Q200, Pulse Withstanding Thick Film; DIGI-KEY_PART_NUMBER: YAG5821CT-ND; DIGIKEY_LINK: https://www.digikey.com/en/products/detail/yageo/SR0603FR-7T100KL/9373095?s=N4IgTCBcDaIMoCUAMA2JBmAYggtAdgBUBGJJAaQBkQBdAXyA; MANUFACTURER_PART_NUMBER: SR0603FR-7T100KL; MF: Yageo; PACKAGE: 1608 Yageo; PURCHASE-URL: https://pricing.snapeda.com/search/part/SR0603FR-7T100KL/?ref=eda
R7 R12 R15 R18 R27 R32 R35 R38 = lib_v3:SR0603FR-7T2K2L; DESCRIPTION: 2.2 kOhms ±1% 0.25W, 1/4W Chip Resistor 0603 (1608 Metric) Automotive AEC-Q200, Pulse Withstanding Thick Film; DIGI-KEY_PART_NUMBER: YAG5834CT-ND; DIGIKEY_LINK: https://www.digikey.com/en/products/detail/yageo/SR0603FR-7T2K2L/9373108?s=N4IgTCBcDaIMoCUAMA2JBmAYggtAdgBUwBpMAGRAF0BfIA; MANUFACTURER_PART_NUMBER: SR0603FR-7T2K2L; MF: Yageo; PACKAGE: 1608 Yageo; PURCHASE-URL: https://pricing.snapeda.com/search/part/SR0603FR-7T2K2L/?ref=eda
R8 R13 R16 R19 R28 R33 R36 R39 = lib_v3:RCS0603120RFKEA: RES SMD 120 OHM 1% 1/4W 0603; DESCRIPTION: 120 Ohms ±1% 0.25W, 1/4W Chip Resistor 0603 (1608 Metric) Automotive AEC-Q200, Pulse Withstanding Thick Film; DIGI-KEY_PART_NUMBER: 541-10426-1-ND; DIGIKEY_LINK: https://www.digikey.com/en/products/detail/vishay-dale/RCS0603120RFKEA/5868381?s=N4IgTCBcDaIKwBYCMBaJAGBYBsaUDkAREAXQF8g; MANUFACTURER_PART_NUMBER: RCS0603120RFKEA; MF: Vishay; PACKAGE: 1508 Vishay; PURCHASE-URL: https://pricing.snapeda.com/search/part/RCS0603120RFKEA/?ref=eda
S1 = lib_v3:1-1825059-7: SPST Flush Slide Sealed 2.54 mm Pitch Surface Mount DIP Switch; DESCRIPTION: Switch DIP OFF ON SPST 4 Flush Slide 0.1A 24VDC Gull Wing 2.54mm SMD T/R; DIGI-KEY_PART_NUMBER: 1-1825059-7-ND; DIGIKEY_LINK: https://www.digikey.com/en/products/detail/te-connectivity-alcoswitch-switches/1-1825059-7/1202121?s=N4IgTCBcDaIIwFo4A4wFYAMaCcCDsCAcgCIgC6AvkA; MANUFACTURER_PART_NUMBER: 1-1825059-7; MF: TE Connectivity; PACKAGE: SMD-6 Omron Electronics; PURCHASE-URL: https://pricing.snapeda.com/search/part/1-1825059-7/?ref=eda
U521 U$26 = lib_v3:LM324KAPWR; DESCRIPTION: Quadruple improved offset and ESD protection operational amplifier 14-TSSOP 0 to 70; DIGI-KEY_PART_NUMBER: 296-18449-1-ND; DIGIKEY_LINK: https://www.digikey.com/en/products/detail/texas-instruments/LM324KAPWR/809732?s=N4IgTCBcDa4JwDYC0BGAHAFg3VSByAIiALoC%2BQA; MANUFACTURER_PART_NUMBER: LM324KAPWR; MF: Texas Instruments; PACKAGE: TSSOP-14 Texas Instruments; PURCHASE-URL: https://pricing.snapeda.com/search/part/LM324KAPWR/?ref=eda
U$1-U$8 = lib_v3:ZXMP7A17: P channel power fet; DIGI-KEY_PART_NUMBER: ZXMP7A17GQTADICT-ND; DIGIKEY_LINK: https://www.digikey.com/en/products/detail/diodes-incorporated/ZXMP7A17GQTA/4747698; NOTE: unclear if this is the correct item; SPICEPREFIX: U
U$9-U$16 = lib_v3:IRLML6244TR; DIGI-KEY_PART_NUMBER: IRLML6244TRPBFCT-ND; DIGIKEY_LINK: https://www.digikey.com/en/products/detail/infineon-technologies/IRLML6244TRPBF/2393871?s=N4IgTCBcDaIJICUAyBZJA2MAWLAVBIAugL5A; SPICEPREFIX: U
U$17-U$20 U$22-U$25 = lib_v3:IRLML6244TR; DIGI-KEY_PART_NUMBER: IRLML6244TRPBFCT-ND; DIGIKEY_LINK: https://www.digikey.com/en/products/detail/infineon-technologies/IRLML6244TRPBF/2393871?s=N4IgTCBcDaIJICUAyBZJA2MAWLAVBIAugL5A
X1 = FH52-10S-0.5SH:FH52-10S-0.5SH; DIGI-KEY_PART_NUMBER: H126109CT-ND; DIGIKEY_LINK: https://www.digikey.com/en/products/detail/hirose-electric-co-ltd/FH52-10S-0-5SH/3466078

## Net classes
0 default: width 0.203 mm, drill 0.406 mm, clearance 0.203 mm
1 power: width 0.61 mm, drill 0.406 mm, clearance 0.203 mm
2 gnd: width 0.305 mm, drill 0.406 mm, clearance 0.203 mm
3 power usb: width 0.508 mm, drill 0.406 mm, clearance 0.203 mm

## Board
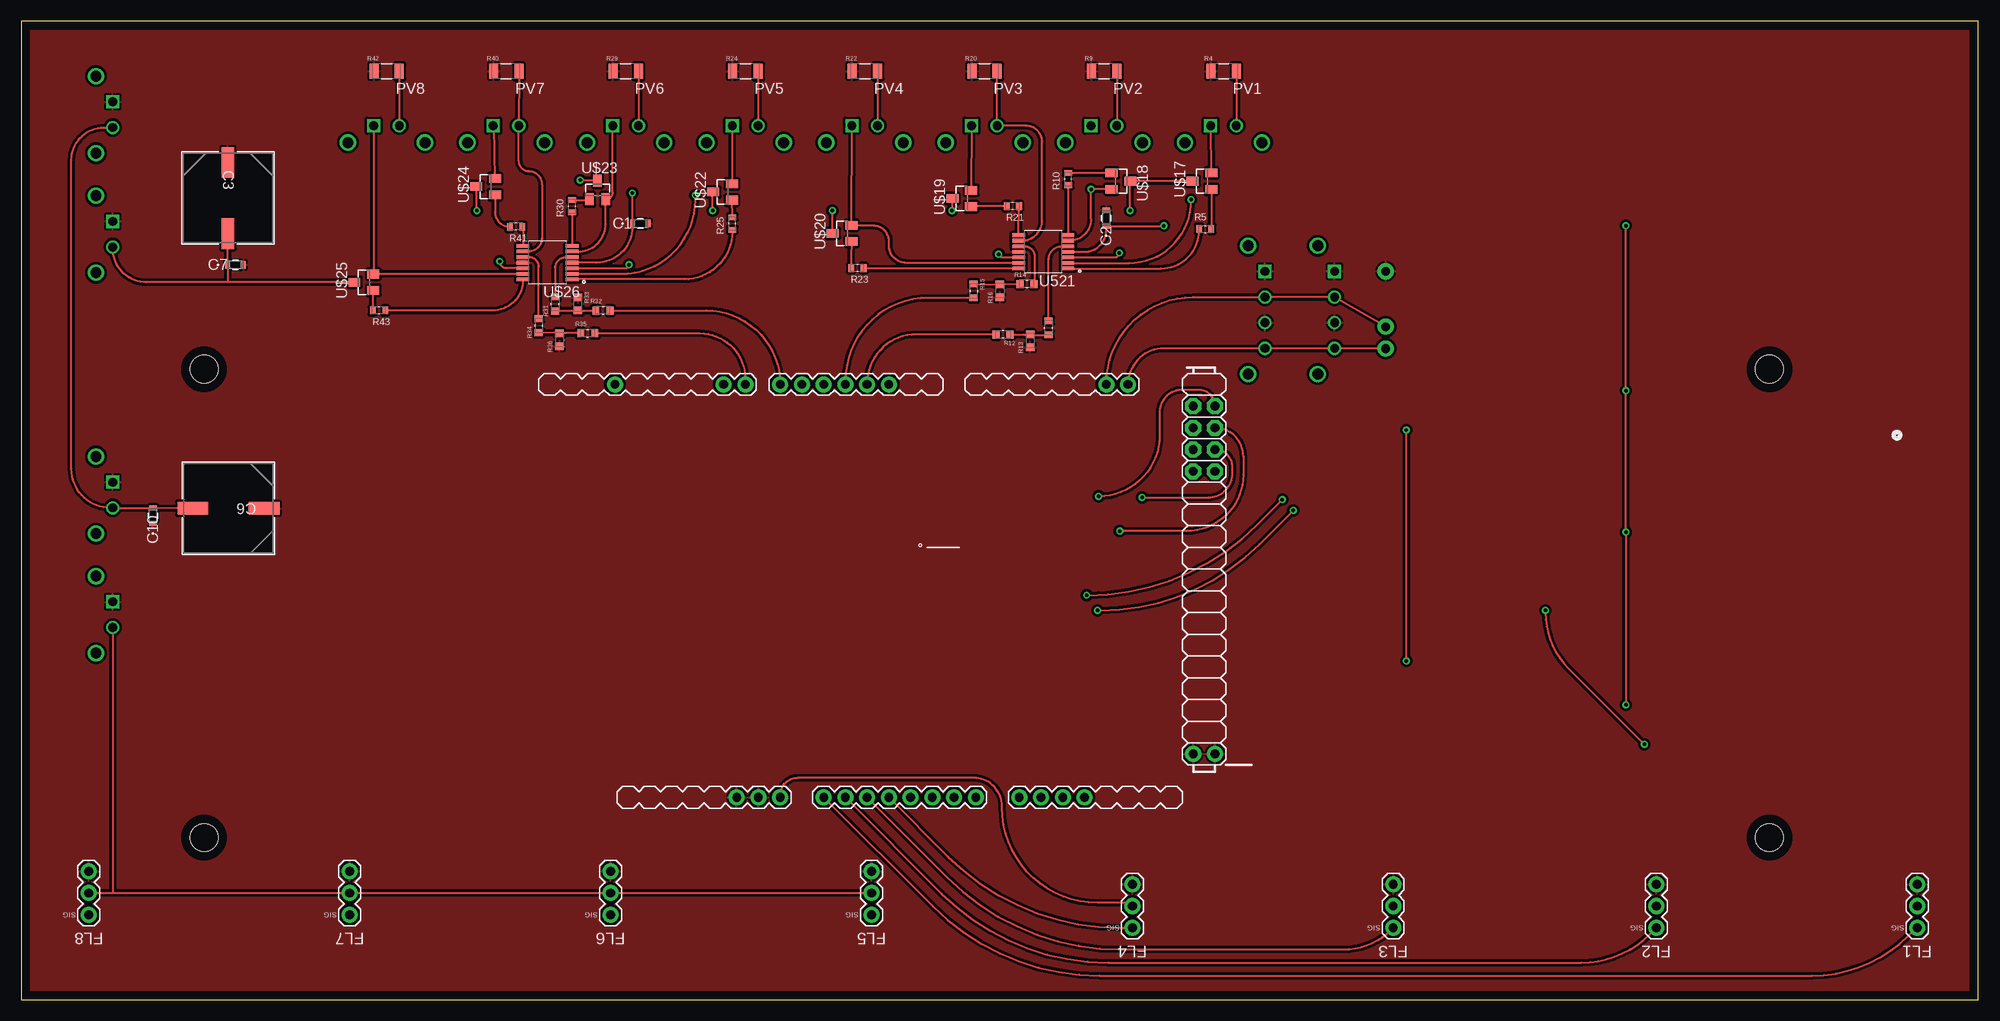
[diagram p5: board, top side]
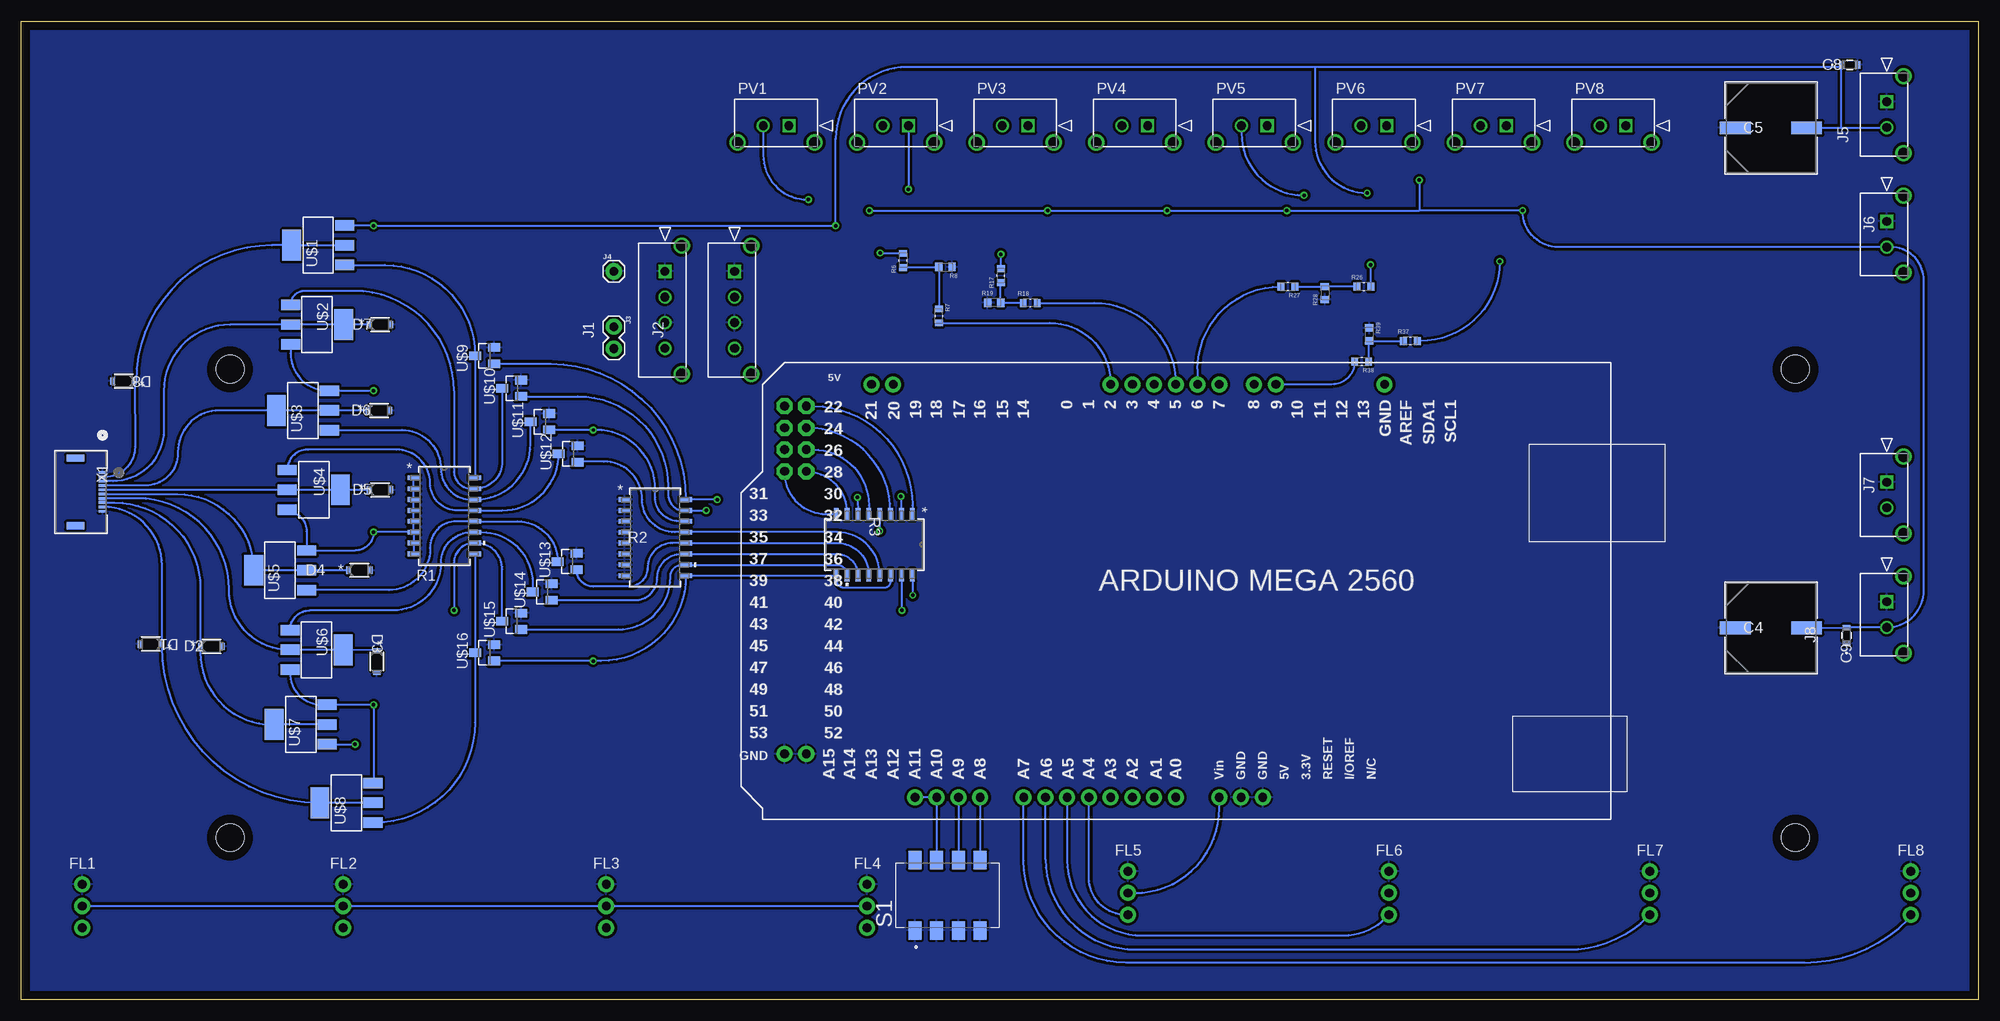
[diagram p6: board, bottom side, seen from below]

Size 228.6 x 114.3 mm. Coordinates in mm from the lower left corner, seen from the top.
Outline: 0,114.3 0,0 228.6,0 228.6,114.3 0,114.3
Copper layers (1*16): Top 0.035mm / dielectric 1.5mm / Bottom 0.035mm
Design rules "default": minimum track width 6mil, minimum drill 0.35mm, track to track 6mil, track to pad 6mil, pad to pad 6mil, via to via 6mil, smd to smd 6mil, copper to edge 40mil, drill to drill 6mil, minimum pad ring 10mil, minimum via ring 8mil, stop-mask expansion 4mil, vias tented up to drill 0mil, thermal gap 10mil
Holes 3.28 mm at 204.22,18.92 204.22,73.66 21.34,18.92 21.34,73.66

### Footprints (pad centres in the part's own frame; a part is rotated, then mirrored left to right if it is on the bottom)
CAP_1608_TDK = smd 0.559 x 0.889: 1 -0.927,0; 2 0.927,0
CAP_J-V_10X10P5_RUB = smd 3.607 x 1.499: 1 -4.153,0; 2 4.153,0
DIO_RB160VAM_ROM = smd 0.457 x 0.838: 1 -1.321,0; 2 1.321,0
1X03_FL = drill 1.016 pad 1.88: 1 0,0; 2 2.54,0; 3 5.08,0
MOLEX_4P_FOOTPRINT = drill 1.02 pad 1.52 square: 1 0,0 | drill 1.02 pad 1.52: 2 -3,0; 3 -6,0; 4 -9,0 | drill 1.27 pad 1.27: M1 3,-1.96; M2 -12,-1.96
1X02 = drill 1.016 pad 1.88: 1 0,0; 2 2.54,0
1X01 = drill 1.016 pad 1.88: 1 0,0
MOLEX_2P_FOOTPRINT = drill 1.02 pad 1.52 square: 1 0,0 | drill 1.02 pad 1.52: 2 -3,0 | drill 1.27 pad 1.27: M1 3,-1.96; M2 -6,-1.96
ARDUINO_MEGA2560_ST_FLIPPED_CUTS = drill 1.016 pad 1.88: 2 58.42,2.54; 3 55.88,2.54; 4 53.34,2.54; 5 50.8,2.54; 6 48.26,2.54; 7 45.72,2.54; 8 41.656,2.54; 9 39.116,2.54; 20 83.82,2.54; 21 86.36,2.54; A0 50.8,50.8; A1 53.34,50.8; A2 55.88,50.8; A3 58.42,50.8; A4 60.96,50.8; A5 63.5,50.8; A6 66.04,50.8; A7 68.58,50.8; A8 73.66,50.8; A9 76.2,50.8; A10 78.74,50.8; A11 81.28,50.8; GND 26.416,2.54; GND. 43.18,50.8; GND.. 40.64,50.8; GND... 93.98,45.72; GND.... 96.52,45.72; VIN 45.72,50.8 | drill 1.016 pad 1.88 octagon: 22 93.98,5.08; 23 96.52,5.08; 24 93.98,7.62; 25 96.52,7.62; 26 93.98,10.16; 27 96.52,10.16; 28 93.98,12.7; 29 96.52,12.7
MOLEX_2P_PVALVES = drill 1.02 pad 1.52 square: 1 0,0 | drill 1.02 pad 1.52: 2 -3,0 | drill 1.27 pad 1.27: M1 3,-1.96; M2 -6,-1.96
BO_4816P = smd 1.422 x 0.559: 1 -3.581,4.445; 2 -3.581,3.175; 3 -3.581,1.905; 4 -3.581,0.635; 5 -3.581,-0.635; 6 -3.581,-1.905; 7 -3.581,-3.175; 8 -3.581,-4.445; 9 3.581,-4.445; 10 3.581,-3.175; 11 3.581,-1.905; 12 3.581,-0.635; 13 3.581,0.635; 14 3.581,1.905; 15 3.581,3.175; 16 3.581,4.445
RESC3116X60N = smd 1.05 x 1.77: 1 -1.485,0; 2 1.485,0
RES_ERJPA3F1001V = smd 0.65 x 0.9: 1 -0.725,0; 2 0.725,0
RESC1608X55N = smd 0.79 x 0.93: 1 -0.82,0; 2 0.82,0
RESC1508X50N = smd 0.86 x 0.98: 1 -0.765,0; 2 0.765,0
SW_1-1825059-7 = smd 2.16 x 1.52: 1 -4.13,3.81; 2 -4.13,1.27; 3 -4.13,-1.27; 4 -4.13,-3.81; 5 4.13,-3.81; 6 4.13,-1.27; 7 4.13,1.27; 8 4.13,3.81
SOP65P640X120-14N = smd 1.57 x 0.41: 1 -2.87,1.95; 2 -2.87,1.3; 3 -2.87,0.65; 4 -2.87,0; 5 -2.87,-0.65; 6 -2.87,-1.3; 7 -2.87,-1.95; 8 2.87,-1.95; 9 2.87,-1.3; 10 2.87,-0.65; 11 2.87,0; 12 2.87,0.65; 13 2.87,1.3; 14 2.87,1.95
SOT223 = smd 1.219 x 2.235: 1 -2.311,-3.099; 2 0,-3.099; 3 2.311,-3.099 | smd 3.6 x 2.2: 4 0,3.099
SOT23 = smd 1 x 1.4: 1 -0.95,-1.1; 2 0.95,-1.1; 3 0,1.1
CONN10_FH52-10S-0.5SH_HIR = smd 0.33 x 0.889: 1 -2.25,2.502; 2 -1.75,2.502; 3 -1.25,2.502; 4 -0.75,2.502; 5 -0.25,2.502; 6 0.25,2.502; 7 0.75,2.502; 8 1.25,2.502; 9 1.75,2.502; 10 2.25,2.502 | smd 0.838 x 2.057: 11 -3.95,-0.673; 12 3.95,-0.673

### Placement (x,y rotation side)
C1  72.3,90.68 0 top
C2  126.75,91.31 90 top
C3  24.13,93.66 270 top
C4  24.19,43.43 0 bottom
C5  24.19,101.85 0 bottom
C6  24.19,57.4 180 top
C7  25.02,85.85 0 top
C8  14.99,109.22 0 bottom
C9  15.37,42.55 90 bottom
C10  15.37,56.52 90 top
D1  213.49,41.53 180 bottom
D2  206.38,41.27 0 bottom
D3  187.07,39.5 270 bottom
D4  189.1,50.16 0 bottom
D5  186.69,59.56 0 bottom
D6  186.82,68.83 0 bottom
D7  186.69,78.87 0 bottom
D8  216.66,72.26 180 bottom
FL1  221.49,8.38 90 top
FL2  191.01,8.38 90 top
FL3  160.27,8.38 90 top
FL4  129.79,8.38 90 top
FL5  99.31,9.91 90 top
FL6  68.83,9.91 90 top
FL7  38.35,9.91 90 top
FL8  7.87,9.91 90 top
J1  153.42,85.09 90 bottom
J2  145.29,85.09 90 bottom
J3  159.38,78.61 270 bottom
J4  159.38,85.09 0 bottom
J5  10.67,104.9 90 bottom
J6  10.67,90.93 90 bottom
J7  10.67,60.45 90 bottom
J8  10.67,46.48 90 bottom
PCB1  42.93,74.42 180 bottom
PV1  138.94,102.11 0 bottom
PV2  124.97,102.11 0 bottom
PV3  111,102.11 0 bottom
PV4  97.03,102.11 0 bottom
PV5  83.06,102.11 0 bottom
PV6  69.09,102.11 0 bottom
PV7  55.12,102.11 0 bottom
PV8  41.15,102.11 0 bottom
R1  179.2,56.52 0 bottom
R2  154.56,53.98 0 bottom
R3  128.96,53.16 270 bottom
R4  140.46,108.46 0 top
R5  138.3,90.04 0 top
R6  125.6,86.36 90 bottom
R7  121.41,79.88 270 bottom
R8  120.65,85.6 180 bottom
R9  126.49,108.46 0 top
R10  122.3,95.89 90 top
R11  120,78.49 90 top
R12  114.68,77.72 180 top
R13  117.86,76.96 90 top
R14  117.47,83.62 0 top
R15  111.25,82.8 270 top
R16  114.3,82.8 90 top
R17  114.17,84.58 90 bottom
R18  110.74,81.41 0 bottom
R19  114.96,81.43 0 bottom
R20  112.52,108.46 0 top
R21  115.82,92.71 180 top
R22  98.55,108.46 0 top
R23  97.66,85.47 180 top
R24  84.58,108.46 0 top
R25  83.06,90.68 90 top
R26  71.75,83.31 0 bottom
R27  80.64,83.31 180 bottom
R28  76.33,82.55 90 bottom
R29  70.61,108.46 0 top
R30  64.34,92.71 90 top
R31  62.36,81.28 90 top
R32  67.94,80.52 0 top
R33  65.02,81.28 270 top
R34  60.45,78.74 90 top
R35  66.17,77.85 0 top
R36  62.87,77.09 90 top
R37  66.34,76.96 0 bottom
R38  72.01,74.55 180 bottom
R39  71.12,77.72 270 bottom
R40  56.64,108.46 0 top
R41  57.78,90.3 180 top
R42  42.67,108.46 0 top
R43  41.78,80.52 180 top
S1  120.4,12.19 90 bottom
U521  119.38,87.38 180 top
U$1  193.93,88.14 90 bottom
U$2  194.06,78.87 270 bottom
U$3  195.71,68.83 90 bottom
U$4  194.44,59.56 270 bottom
U$5  198.37,50.16 90 bottom
U$6  194.11,40.86 270 bottom
U$7  195.96,32.13 90 bottom
U$8  190.63,22.99 90 bottom
U$9  174.5,75.24 90 bottom
U$10  171.32,71.44 90 bottom
U$11  168.02,67.52 90 bottom
U$12  164.72,63.75 90 bottom
U$13  164.85,51.18 90 bottom
U$14  167.77,47.62 90 bottom
U$15  171.32,44.2 90 bottom
U$16  174.5,40.51 90 bottom
U$17  137.92,95.63 90 top
U$18  128.48,95.63 270 top
U$19  109.86,93.6 90 top
U$20  95.89,89.53 90 top
U$22  81.92,94.36 90 top
U$23  67.31,94.61 0 top
U$24  54.23,95 90 top
U$25  40.01,83.82 90 top
U$26  61.47,86.11 180 top
X1  221.62,59.31 270 bottom

### Tracks (layer width: path | path; a pad name or v marks a point on that pad's centre or on a via)
+10V  (via drill 0.41)
  Top 0.254: U$17.3 U$18.3 129.54,95.59 v129.54,92.2 | U$19.3 108.71,93.56 v108.71,92.2 | U$20.3 v94.74,92.2 | U$24.3 53.21,94.91 v53.21,92.2 | U$23.3 67.27,95.76 v65.28,95.76 | FL8.2 10.67,12.45 | 10.67,12.45 FL7.2 FL6.2 FL5.2 | U$22.3 arc90 80.77,94.32 v80.77,92.2 | U$25.3 24.09,83.82 | 24.09,83.82 14.61,83.82 arc-90 10.67,87.76 J6.2 | J8.2 10.67,12.45 | PCB1.VIN 88.65,23.88 arc-90 90.68,25.91 111.25,25.91 arc-90 114.55,22.61 114.55,22.48 arc90 125.73,11.3 129.41,11.3 FL4.2 | 24.09,83.82 C7.1 C3.2
  Bottom 0.254: 65.28,92.2 v80.77,92.2 v94.74,92.2 v108.71,92.2 v129.54,92.2 | 65.28,92.2 v53.21,92.2 53.21,92.12 arc-90 49.02,87.93 J6.2 10.21,87.93 arc90 6.35,84.07 6.35,47.8 arc90 J8.2 C9.2 C4.2 | v65.28,95.76 65.28,92.2 | FL1.2 FL2.2 FL3.2 FL4.2 | FL5.2 98.55,12.45 arc-90 88.65,22.35 PCB1.VIN
+24V  (via drill 0.41)
  Top 0.254: v187.45,34.44 v187.45,54.61 v187.45,71.14 v187.45,90.42 | J5.2 9.65,101.9 arc90 5.84,98.09 5.84,62.02 arc90 10.41,57.45 J7.2 C10.2 C6.2 | U$26.4 67.19,86.11 arc90 71.38,90.3 C1.1 arc-90 C1.1 v71.37,94.23 | U521.4 124.21,87.38 arc90 126.75,89.92 C2.1 133.44,90.39 arc90 v133.48,90.42
  Bottom 0.254: U$8.3 arc-90 187.5,25.27 187.45,25.27 v187.45,34.44 U$7.3 193.53,34.44 arc90 197.21,38.12 U$6.3 | 192.63,71.17 arc-90 U$3.3 | R1.8 R1.7 R1.6 | R1.1 R1.2 R1.3 R1.4 R1.5 R1.6 | C5.2 20.04,101.9 16,101.9 | 16,101.9 J5.2 | 16,101.9 16,108.97 | 16,108.97 16,109.13 arc90 C8.1 | 16,108.97 77.47,108.97 | 77.47,108.97 125.09,108.97 arc-90 133.48,100.58 v133.48,90.42 v187.45,90.42 U$1.3 | R1.6 v187.45,54.61 arc90 189.59,52.48 U$5.3 195.28,54.74 arc-90 197.54,57 U$4.3 | 77.47,108.97 77.47,100.33 arc-90 v71.37,94.23 | 192.63,71.17 arc-90 U$3.3 | U$2.3 197.16,75.49 arc-90 192.84,71.17 192.63,71.17 | U$3.3 v187.45,71.14
GNDA
  pour Top (isolate 0.305): 0.08,0.08 228.52,0.08 228.52,114.22 0.08,114.22
  pour Bottom (isolate 0.305): 0.08,0.08 228.52,0.08 228.52,114.22 0.08,114.22
N$1
  Bottom 0.254: U$1.2 U$1.4 199.34,88.13 arc-90 215.21,72.26 D8.1 215.33,64.58 arc90 218.84,61.06 219.1,61.06 X1.2
N$1-1
  Bottom 0.254: U$1.1 186.14,85.83 arc90 175.6,75.29 U$9.3 R1.16
N$1-2  (via drill 0.41)
  Top 0.254: v124.46,47.24 124.51,47.24 arc45 144.37,55.47 v147.32,58.42
  Bottom 0.254: U$9.1 166.73,74.29 arc90 150.98,58.54 R2.16 v147.32,58.42 | v124.46,47.24 124.46,49.53 arc-90 R3.16
N$2
  Bottom 0.254: D7.1 U$2.4 U$2.2 204.22,78.87 arc-90 211.96,71.12 211.96,66.53 arc90 217.92,60.57 218.72,60.57 arc-90 218.72,60.56 219.1,60.56 X1.3
N$2-1
  Bottom 0.254: U$10.3 172.42,62.87 arc90 175.59,59.69 R1.15 176.02,59.69 arc90 178.05,61.72 178.05,71.12 arc-90 189.74,82.8 195.53,82.8 arc-90 U$2.1
N$2-2  (via drill 0.41)
  Top 0.254: v125.73,45.47 126,45.47 arc45 144.62,53.18 v148.59,57.15
  Bottom 0.254: U$10.1 163.58,70.48 arc90 153.03,59.94 153.03,59.05 arc-90 151.05,57.07 arc-90 R2.15 v148.59,57.15 | v125.73,45.47 125.73,49.53 arc-90 R3.15
N$3
  Bottom 0.254: X1.4 219.1,60.06 218.72,60.06 arc90 218.72,60.07 214.12,60.07 arc-90 210.31,63.88 210.31,64.01 arc90 205.49,68.83 U$3.4 U$3.2 D6.1
N$3-1
  Bottom 0.254: U$11.3 169.12,64.9 arc90 175.6,58.42 R1.14 176.02,58.42 arc90 179.58,61.98 arc-90 184.15,66.55 192.58,66.55 U$3.1
N$4
  Bottom 0.254: D5.1 U$4.4 U$4.2 219.1,59.56 X1.5
N$4-1
  Bottom 0.254: U$12.3 arc90 172.42,57.15 R1.13 177.67,57.15 arc90 180.85,60.33 arc-90 184.78,64.26 195.15,64.26 arc-90 U$4.1
N$4-2
  Bottom 0.254: U$12.1 arc90 163.56,62.87 160.53,62.87 arc90 156.08,58.42 arc-90 152.27,54.61 R2.13 133.28,54.61 arc90 128.32,49.66 R3.13
N$5
  Bottom 0.254: D4.1 U$5.2 U$5.4 201.47,50.18 arc-90 210.36,59.07 218.72,59.07 arc-90 218.72,59.06 219.1,59.06 X1.6
N$5-1
  Bottom 0.254: U$13.3 arc-90 170.65,55.88 R1.12 177.8,55.88 arc-90 180.85,52.83 180.85,52.68 arc90 185.67,47.85 U$5.1
N$5-2
  Bottom 0.254: R3.12 129.59,49.66 arc-90 133.28,53.34 R2.12 152.53,53.34 arc-90 155.45,50.42 arc90 157.61,48.26 161.78,48.26 arc90 U$13.1
N$6
  Bottom 0.254: D3.1 U$6.4 U$6.2 197.36,40.86 arc90 204.34,47.84 204.34,47.9 arc-90 215.01,58.57 218.72,58.57 arc-90 218.72,58.56 219.1,58.56 X1.7
N$6-1
  Bottom 0.254: U$6.1 arc90 194.91,45.47 185.17,45.47 arc-90 179.58,51.05 arc90 176.02,54.61 R1.11 174.84,54.61 arc90 168.87,48.64 U$14.3
N$6-2
  Bottom 0.254: U$14.1 156.91,46.67 arc-90 154.31,49.28 arc90 151.51,52.07 R2.11 133.35,52.07 arc90 R3.11
N$7
  Bottom 0.254: U$7.2 U$7.4 199.31,32.13 arc90 207.7,40.51 D2.1 207.7,48.03 arc-90 217.73,58.07 218.72,58.07 arc-90 218.72,58.06 219.1,58.06 X1.8
N$7-1  (via drill 0.41)
  Top 0.254: v178.05,45.47 178.05,45.19 arc45 180.75,38.68 v189.61,29.82
  Bottom 0.254: U$15.3 172.42,50.29 arc-90 175.47,53.34 R1.10 175.77,53.34 arc-90 178.05,51.05 v178.05,45.47 | 192.91,29.77 arc90 U$7.1 v189.61,29.82
N$7-2
  Bottom 0.254: U$15.1 158.88,43.25 arc-90 152.78,49.34 152.78,49.4 arc90 151.38,50.8 R2.10 133.35,50.8 arc90 R3.10
N$8
  Bottom 0.254: U$8.2 U$8.4 193.85,22.99 arc90 212.16,41.29 D1.1 212.15,50.72 arc-90 219,57.56 219.1,57.56 X1.9
N$8-1
  Bottom 0.254: R1.9 U$16.3 175.6,32.36 arc90 187.28,20.68 U$8.1
N$8-2  (via drill 0.41)
  Top 0.254: v161.8,39.56 v161.8,66.55
  Bottom 0.254: R3.14 127.05,48.84 arc90 127.76,48.13 132.46,48.13 arc90 133.4,49.07 R3.9 arc90 133.45,49.53 R2.9 150.98,49.47 arc90 160.88,39.56 v161.8,39.56 U$16.1 | R2.14 151.76,55.88 arc90 154.56,58.67 154.56,59.69 arc-90 161.42,66.55 v161.8,66.55 U$11.1
N$26
  Top 0.254: U$17.1 R5.2 arc90 R5.2
N$27
  Top 0.254: U521.1 arc90 U521.1 133.13,85.42 arc90 137.58,89.87 R5.1
N$28  (via drill 0.41)
  Top 0.254: U521.3 127.75,86.73 arc90 v128.27,87.25
  Bottom 0.254: v128.27,87.25 125.67,87.25 arc90 R6.2
N$29
  Bottom 0.254: R8.2 R7.1 | R8.2 arc-90 R8.2 | R6.1 121.47,85.54 arc-90 R8.2
N$30
  Top 0.254: U521.7 122.25,95.11 arc-90 R10.1
N$32
  Top 0.254: U$18.1 122.33,96.58 arc-90 R10.2
N$34
  Top 0.254: R12.1 R13.2 | R13.2 arc90 R13.2 | R11.1 117.91,77.67 arc-90 R13.2
N$35
  Top 0.254: R11.2 120,86.47 arc-90 121.54,88.01 122.23,88.01 arc90 U521.5
N$36
  Top 0.254: R15.1 R16.2 R14.1
N$37
  Top 0.254: U521.10 117.21,88.03 arc-90 118.36,86.87 118.36,83.62 arc-90 R14.2
N$38
  Bottom 0.254: R17.1 arc-90 114.19,83.74 R19.2 111.59,81.43 arc90 R18.1
N$39  (via drill 0.41)
  Top 0.254: U521.12 114.64,86.73 arc-90 114.17,87.19 arc90 v114.17,87.09
  Bottom 0.254: R17.2 v114.17,87.09
N$42
  Top 0.254: R21.2 111.02,92.71 arc90 U$19.1
N$43
  Top 0.254: U521.8 R21.1
N$46
  Top 0.254: U$20.1 96.94,86.74 R23.2
N$47
  Top 0.254: U521.14 98.43,85.43 arc-90 R23.1
N$50
  Top 0.254: R25.2 U$22.1
N$51
  Top 0.254: R25.1 83.06,89.74 arc-90 77.47,84.16 U$26.1
N$52
  Bottom 0.254: R26.1 arc-90 R26.1 R28.2 arc90 R28.2 R27.1
N$54
  Top 0.254: R30.2 66.28,93.44 arc90 U$23.1
N$56  (via drill 0.41)
  Top 0.254: U$26.3 70.6,85.46 arc90 v70.99,85.85
  Bottom 0.254: v70.99,85.85 70.99,83.37 arc-90 R26.2
N$57
  Top 0.254: R31.1 arc-90 62.41,80.52 R33.2 arc-90 R33.2 R32.1
N$58
  Top 0.254: R31.2 62.36,85.47 arc-90 63.63,86.74 64.32,86.74 U$26.5
N$59
  Top 0.254: R35.1 R36.2 R34.1
N$60
  Top 0.254: R34.2 60.45,85.6 arc90 59.29,86.76 U$26.10
N$61
  Bottom 0.254: R37.1 R39.2 arc-90 71.19,76.89 R38.1
N$62  (via drill 0.41)
  Top 0.254: U$26.12 56.68,85.46 arc-90 v55.88,86.26
  Bottom 0.254: v55.88,86.26 55.88,86.23 arc90 65.15,76.96 R37.2
N$65
  Top 0.254: U$24.1 55.33,92.03 arc90 R41.2
N$66
  Top 0.254: R41.1 arc-90 58.6,90.21 U$26.8
N$69
  Top 0.254: R43.2 41.06,82.82 arc-90 U$25.1
N$70
  Top 0.254: U$26.14 58.6,84.07 arc-90 55.04,80.52 R43.1
N$71
  Top 0.254: R30.1 U$26.7
N$80
  Bottom 0.254: PCB1.A8 S1.5
N$81
  Bottom 0.254: PCB1.A9 S1.6
N$82
  Top 0.254: J3.1 J1.2 J2.2 136.91,82.09 arc90 126.75,71.93 PCB1.20
N$83
  Bottom 0.254: S1.7 PCB1.A10 PCB1.A11
N$84
  Top 0.254: J3.2 arc90 159.4,76.09 J1.4 J2.4 133.48,76.09 arc90 129.29,71.9 PCB1.21
N$A0
  Top 0.254: FL1.1 220.47,7.46 arc-45 209.21,2.79 125.97,2.79 arc-45 106.48,10.87 PCB1.A0
N$A1
  Top 0.254: FL2.1 190.25,7.62 arc-45 182.27,4.32 126.97,4.32 arc-45 107.51,12.38 PCB1.A1
N$A2
  Top 0.254: FL3.1 160.06,8.17 arc-45 154.44,5.84 128.49,5.84 arc-45 108.17,14.26 PCB1.A2
N$A3
  Top 0.254: PCB1.A3 108.27,16.7 arc45 128.34,8.38 FL4.1
N$A4
  Bottom 0.254: FL5.1 99.57,9.91 arc90 103.89,14.22 PCB1.A4
N$A5
  Bottom 0.254: PCB1.A5 106.43,16.26 arc-90 97.66,7.49 74.13,7.49 arc-45 69.21,9.53 FL6.1
N$A6
  Bottom 0.254: PCB1.A6 108.97,16.38 arc-90 98.42,5.84 47.87,5.84 arc-45 38.56,9.7 FL7.1
N$A7
  Bottom 0.254: PCB1.A7 111.51,16.26 arc-90 99.57,4.32 20.3,4.32 arc-45 8.13,9.36 FL8.1
N$PV1_1
  Top 0.254: U$17.2 138.97,102.08 PV1.1
N$PV1_2  (via drill 0.41)
  Top 0.254: R4.2 PV1.2 | U521.2 129.41,86.08 arc90 136.65,93.31 v136.65,93.47
  Bottom 0.254: PV1.2 141.94,98.68 arc-90 136.73,93.47 v136.65,93.47
N$PV2_1  (via drill 0.41)
  Top 0.254: U521.6 122.43,88.68 arc90 124.97,91.22 v124.97,94.68 U$18.2
  Bottom 0.254: PV2.1 v124.97,94.68
N$PV2_2
  Top 0.254: R9.2 PV2.2
N$PV3_1
  Top 0.254: PV3.1 U$19.2
N$PV3_2
  Top 0.254: PV3.2 | PV3.2 R20.2 | U521.9 116.87,88.68 arc90 119.25,91.06 119.25,100.2 arc90 117.35,102.11 PV3.2 | PV3.2
N$PV4_1
  Top 0.254: PV4.1 U$20.2 arc90 97.05,90.42 99.57,90.42 arc-90 101.35,88.65 101.35,88.14 arc90 103.41,86.08 U521.13
N$PV4_2
  Top 0.254: R22.2 PV4.2
N$PV5_1
  Top 0.254: PV5.1 U$22.2
N$PV5_2  (via drill 0.41)
  Top 0.254: U$26.2 70.1,84.81 arc90 78.74,93.44 v78.74,93.98 | R24.2 PV5.2
  Bottom 0.254: PV5.2 86.06,101.22 arc-90 78.82,93.98 v78.74,93.98
N$PV6_1
  Top 0.254: U$26.6 65.02,87.41 arc90 68.26,90.64 U$23.2 arc90 69.09,94.34 PV6.1
N$PV6_2
  Top 0.254: R29.2 PV6.2
N$PV7_1
  Top 0.254: U$24.2 55.26,101.97 PV7.1
N$PV7_2
  Top 0.254: R40.2 PV7.2 58.12,97.97 arc90 59.31,96.77 arc-90 60.83,95.25 60.83,89.03 arc-90 59.21,87.41 U$26.9
N$PV8_1
  Top 0.254: PV8.1 41.15,84.81 arc-90 U$25.2 arc-90 41.14,84.81 U$26.13
N$PV8_2
  Top 0.254: R42.2 PV8.2
P1
  Bottom 0.254: R7.2 108.46,79.06 arc90 101.35,71.95 PCB1.2
P2
  Top 0.254: R12.2 104.52,77.72 arc90 98.81,72.01 PCB1.3
P3
  Top 0.254: R15.2 105.92,81.98 arc90 96.27,72.33 PCB1.4
P4
  Bottom 0.254: R18.2 103.25,81.41 arc90 PCB1.5
P5
  Bottom 0.254: PCB1.6 91.19,73.66 arc90 81.53,83.31 R27.2
P6
  Top 0.254: R32.2 80.01,80.52 arc-90 PCB1.7
P7
  Top 0.254: R35.2 79.25,77.85 arc-90 84.58,72.52 PCB1.8
P8
  Bottom 0.254: R38.2 arc90 75.5,71.88 PCB1.9
V1
  Bottom 0.254: PCB1.22 136.07,69.34 arc90 124.51,57.78 R3.1
V2  (via drill 0.41)
  Top 0.254: PCB1.23 arc90 137.54,71.25 135.64,71.25 arc90 132.97,68.58 132.97,65.91 arc-90 v125.86,58.8
  Bottom 0.254: v125.86,58.8 125.86,56.82 arc-90 R3.2
V3
  Bottom 0.254: R3.3 127.05,57.02 arc-90 136.83,66.8 PCB1.24
V4  (via drill 0.41)
  Top 0.254: v128.32,54.74 136.14,54.74 arc90 142.75,61.34 142.75,63.5 arc90 PCB1.25
  Bottom 0.254: R3.4 v128.32,54.74
V5
  Bottom 0.254: PCB1.26 136.07,64.26 arc90 129.59,57.78 R3.5
V6  (via drill 0.41)
  Top 0.254: v130.94,58.67 138.68,58.67 arc90 141.48,61.47 141.48,62.23 arc90 PCB1.27
  Bottom 0.254: v130.94,58.67 R3.6
V7
  Bottom 0.254: PCB1.28 136.91,61.67 arc90 132.13,56.9 R3.7
V8
  Bottom 0.254: PCB1.29 139.45,61.57 arc-90 134.62,56.74 R3.8